# Altium project slave-12-ltc6811-1.PrjPcb (part 1 of 2)
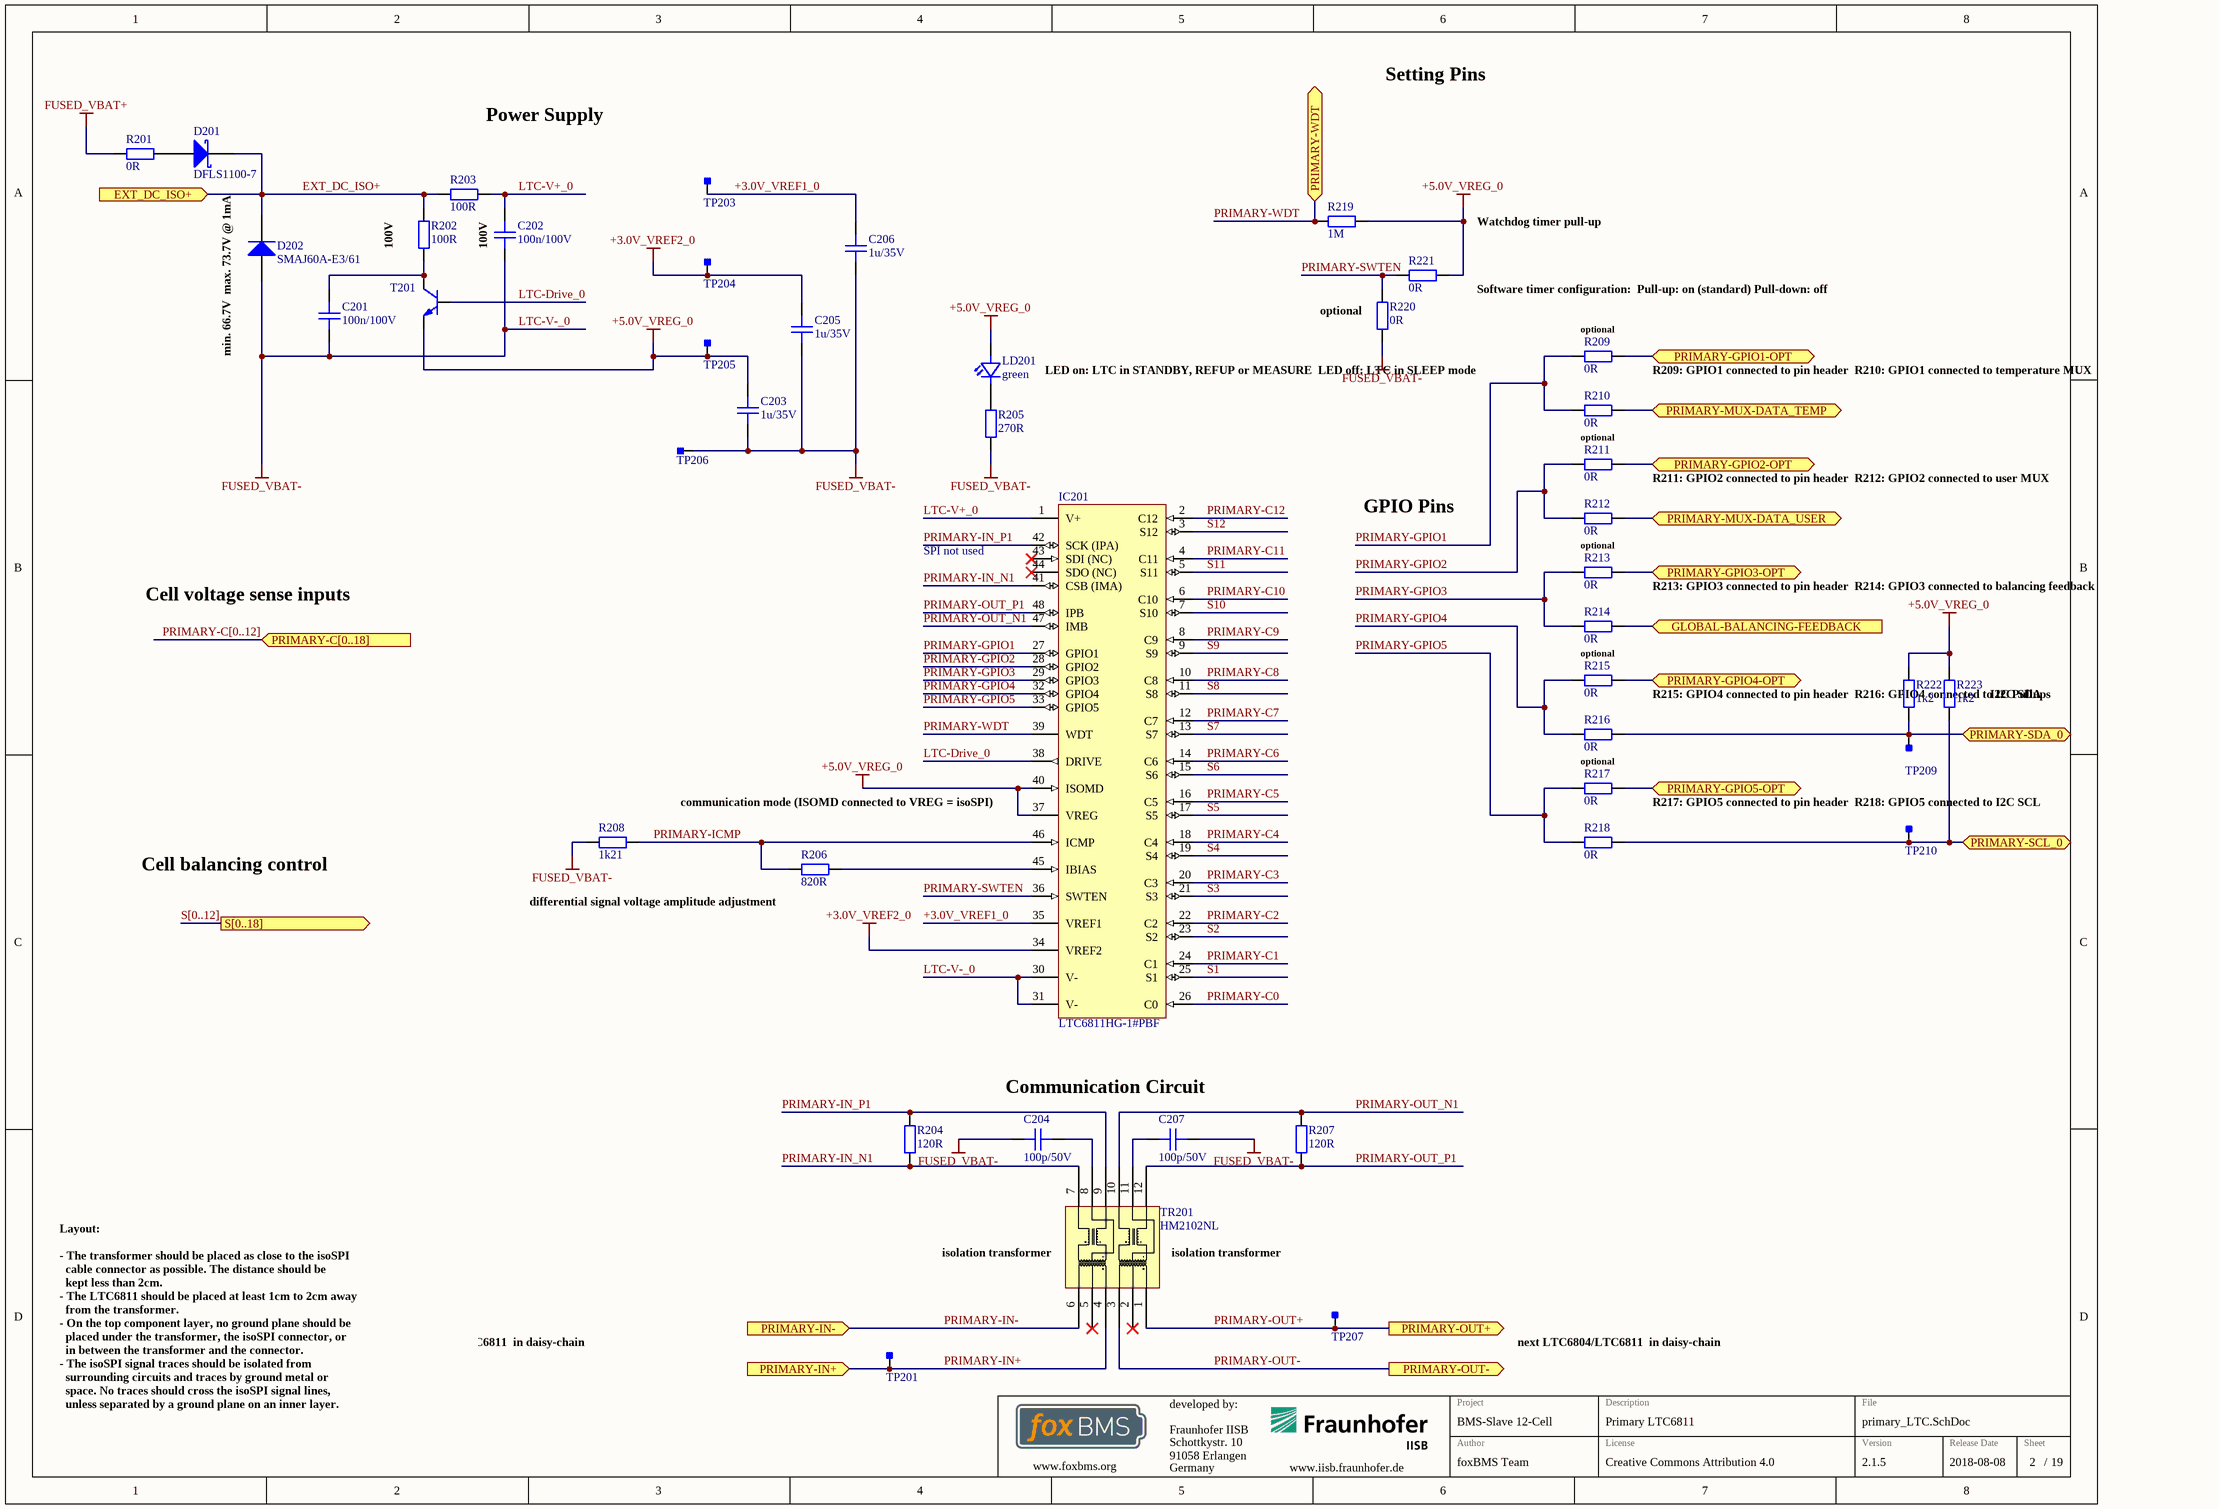
[diagram p0: primary_LTC.SchDoc]
GlobalDate: 2018-08-08; GlobalLicense: Creative Commons Attribution 4.0; GlobalProject: BMS-Slave 12-Cell; GlobalVersion: 2.1.5
13 sheets, 315 parts. Net scope: hierarchical (ports join the sheet entries above them; power ports are global).
Board file: slave.PcbDoc
Sheets:
  primary_LTC.SchDoc
  secondary_LTC.SchDoc
  cell_fuses.SchDoc
  primary_decoupling.SchDoc
  secondary_decoupling.SchDoc
  passive_balancing.SchDoc
  secon_analog_in.SchDoc
  secondary_DIO.SchDoc
  secondary_EEPROM_and_T.SchDoc
  connectors.SchDoc
  daisy_chain_connectors.SchDoc
  ext_supply_con.SchDoc
  bat_connectors.SchDoc

## Sheet primary_LTC.SchDoc: foxBMS BMS-Slave 12-Cell
size A3; DocumentNumber: 2; SheetNumber: 2; SheetTotal: 19; AUTHOR: Fraunhofer IISB foxBMS Team; SheetDescription: Primary LTC6811

### Parts
C201  100n/100V  [CAPC2012X14N]
C202  100n/100V  [CAPC2012X14N]
C203  1u/35V  [CAPC1608X08N]
C204  100p/50V  [CAPC1608X08N]
C205  1u/35V  [CAPC1608X08N]
C206  1u/35V  [CAPC1608X08N]
C207  100p/50V  [CAPC1608X08N]
D201  DFLS1100-7  [DIOD-POWERDI123-2_V]
D202  SMAJ60A-E3/61  [VISH-DO-214AC-2_N]
IC201  LTC6811HG-1#PBF  [LT-G-48_L]
LD201  green  [LEDC1608X07N]
R201  0R  [RESC2012X05N]
R202  100R  [RESC2012X05N]
R203  100R  [RESC2012X05N]
R204  120R  [RESC1608X05N]
R205  270R  [RESC1608X05N]
R206  820R  [RESC1608X05N]
R207  120R  [RESC1608X05N]
R208  1k21  [RESC1608X05N]
R209  0R  [RESC1608X05N]
R210  0R  [RESC1608X05N]
R211  0R  [RESC1608X05N]
R212  0R  [RESC1608X05N]
R213  0R  [RESC1608X05N]
R214  0R  [RESC1608X05N]
R215  0R  [RESC1608X05N]
R216  0R  [RESC1608X05N]
R217  0R  [RESC1608X05N]
R218  0R  [RESC1608X05N]
R219  1M  [RESC1608X05N]
R220  0R  [RESC1608X05N]
R221  0R  [RESC1608X05N]
R222  1k2  [RESC1608X05N]
R223  1k2  [RESC1608X05N]
T201  PBHV8115Z  [SOT230P700X180-4N]  (value not drawn)
TP201  Testpoint_Square  [Testpoint_S1]  (value not drawn)  (no BOM)
TP203  Testpoint_Square  [Testpoint_S1]  (value not drawn)  (no BOM)
TP204  Testpoint_Square  [Testpoint_S1]  (value not drawn)  (no BOM)
TP205  Testpoint_Square  [Testpoint_S1]  (value not drawn)  (no BOM)
TP206  Testpoint_Square  [Testpoint_S1]  (value not drawn)  (no BOM)
TP207  Testpoint_Square  [Testpoint_S1]  (value not drawn)  (no BOM)
TP209  Testpoint_Square  [Testpoint_S1]  (value not drawn)  (no BOM)
TP210  Testpoint_Square  [Testpoint_S1]  (value not drawn)  (no BOM)
TR201  HM2102NL  [HM2102NL]

### Ports
EXT_DC_ISO+ (in), GLOBAL-BALANCING-FEEDBACK (in), PRIMARY-C[0..18] (in), PRIMARY-GPIO1-OPT (bidir), PRIMARY-GPIO2-OPT (bidir), PRIMARY-GPIO3-OPT (bidir), PRIMARY-GPIO4-OPT (bidir), PRIMARY-GPIO5-OPT (bidir), PRIMARY-IN+ (in), PRIMARY-IN- (in), PRIMARY-MUX-DATA_TEMP (bidir), PRIMARY-MUX-DATA_USER (bidir), PRIMARY-OUT+ (out), PRIMARY-OUT- (out), PRIMARY-SCL_0 (bidir), PRIMARY-SDA_0 (bidir), PRIMARY-WDT (bidir), S[0..18] (out)

### Nets
+3.0V_VREF2_0: C205.2 IC201.34(VREF2) TP204.1
+5.0V_VREG_0: C203.2 IC201.37(VREG) IC201.40(ISOMD) LD201.2(A) R219.2 R221.2 R222.2 R223.2 T201.3(E) TP205.1
FUSED_VBAT+: R201.1
FUSED_VBAT-: C201.2 C202.2 C203.1 C204.1 C205.1 C206.1 C207.1 D202.2(A) IC201.30(V-) IC201.31(V-) R205.1 R208.1 R220.1 TP206.1  [also labelled LTC-V-_0]
+3.0V_VREF1_0: C206.2 IC201.35(VREF1) TP203.1
EXT_DC_ISO+: D201.2(K) D202.1(K) R202.2 R203.1 ; port EXT_DC_ISO+
LTC-Drive_0: IC201.38(DRIVE) T201.1(B)
LTC-V+_0: C202.1 IC201.1(V+) R203.2
PRIMARY-C0: IC201.26(C0)
PRIMARY-C1: IC201.24(C1)
PRIMARY-C2: IC201.22(C2)
PRIMARY-C3: IC201.20(C3)
PRIMARY-C4: IC201.18(C4)
PRIMARY-C5: IC201.16(C5)
PRIMARY-C6: IC201.14(C6)
PRIMARY-C7: IC201.12(C7)
PRIMARY-C8: IC201.10(C8)
PRIMARY-C9: IC201.8(C9)
PRIMARY-C10: IC201.6(C10)
PRIMARY-C11: IC201.4(C11)
PRIMARY-C12: IC201.2(C12)
PRIMARY-GPIO1: IC201.27(GPIO1) R209.2 R210.2
PRIMARY-GPIO2: IC201.28(GPIO2) R211.2 R212.2
PRIMARY-GPIO3: IC201.29(GPIO3) R213.2 R214.2
PRIMARY-GPIO4: IC201.32(GPIO4) R215.2 R216.2
PRIMARY-GPIO5: IC201.33(GPIO5) R217.2 R218.2
PRIMARY-ICMP: IC201.46(ICMP) R206.1 R208.2
PRIMARY-IN+: TP201.1 TR201.4 ; port PRIMARY-IN+
PRIMARY-IN-: TR201.6 ; port PRIMARY-IN-
PRIMARY-IN_N1: IC201.41(CSB_(IMA)) R204.2 TR201.7
PRIMARY-IN_P1: IC201.42(SCK_(IPA)) R204.1 TR201.9
PRIMARY-OUT+: TP207.1 TR201.1 ; port PRIMARY-OUT+
PRIMARY-OUT-: TR201.3 ; port PRIMARY-OUT-
PRIMARY-OUT_N1: IC201.47(IMB) R207.2 TR201.10
PRIMARY-OUT_P1: IC201.48(IPB) R207.1 TR201.12
PRIMARY-SWTEN: IC201.36(SWTEN) R220.2 R221.1
PRIMARY-WDT: IC201.39(WDT) R219.1 ; port PRIMARY-WDT
S1: IC201.25(S1)
S2: IC201.23(S2)
S3: IC201.21(S3)
S4: IC201.19(S4)
S5: IC201.17(S5)
S6: IC201.15(S6)
S7: IC201.13(S7)
S8: IC201.11(S8)
S9: IC201.9(S9)
S10: IC201.7(S10)
S11: IC201.5(S11)
S12: IC201.3(S12)
NetC201_1: C201.1 R202.1 T201.2(C) T201.4(C)
NetC204_2: C204.2 TR201.8
NetC207_2: C207.2 TR201.11
NetD201_1: D201.1(A) R201.2
NetIC201_45: IC201.45(IBIAS) R206.2
NetLD201_1: LD201.1(C) R205.2
NetR209_1: R209.1 ; port PRIMARY-GPIO1-OPT
NetR210_1: R210.1 ; port PRIMARY-MUX-DATA_TEMP
NetR211_1: R211.1 ; port PRIMARY-GPIO2-OPT
NetR212_1: R212.1 ; port PRIMARY-MUX-DATA_USER
NetR213_1: R213.1 ; port PRIMARY-GPIO3-OPT
NetR214_1: R214.1 ; port GLOBAL-BALANCING-FEEDBACK
NetR215_1: R215.1 ; port PRIMARY-GPIO4-OPT
NetR216_1: R216.1 R222.1 TP209.1 ; port PRIMARY-SDA_0
NetR217_1: R217.1 ; port PRIMARY-GPIO5-OPT
NetR218_1: R218.1 R223.1 TP210.1 ; port PRIMARY-SCL_0

Not connected (* = marked no-connect by the designer): IC201 43(SDI_(NC))* 44(SDO_(NC))*; TR201 2* 5*

### Buses and harness runs
bus PRIMARY-C[0..12] = port PRIMARY-C[0..18]
bus S[0..12] = port S[0..18]

### Notes on the sheet
- Setting Pins
- Power Supply
- (near R202) 100V
- (near C202) 100V
- Watchdog timer pull-up
- min. 66.7V
  max. 73.7V @ 1mA
- (near R220) optional
- Software timer configuration:
  Pull-up: on (standard)
  Pull-down: off
- LED on: LTC in STANDBY, REFUP or MEASURE
  LED off: LTC in SLEEP mode
- (near R209) optional
- R209: GPIO1 connected to pin header
  R210: GPIO1 connected to temperature MUX
- optional
- GPIO Pins
- R211: GPIO2 connected to pin header
  R212: GPIO2 connected to user MUX
- SPI not used
- R213: GPIO3 connected to pin header
  R214: GPIO3 connected to balancing feedback
- Cell voltage sense inputs
- R215: GPIO4 connected to pin header
  R216: GPIO4 connected to I2C SDA
- (near R223) I2C Pullups
- communication mode (ISOMD connected to VREG = isoSPI)
- (near TP210) R217: GPIO5 connected to pin header
  R218: GPIO5 connected to I2C SCL
- Cell balancing control
- (near R206) differential signal voltage amplitude adjustment
- Communication Circuit
- (near TR201) isolation transformer
- previous LTC6804/LTC6811
  in daisy-chain
- next LTC6804/LTC6811
  in daisy-chain
- Layout:
  - The transformer should be placed as close to the isoSPI
  cable connector as possible. The distance should be
  kept less than 2cm.
  - The LTC6811 should be placed at least 1cm to 2cm away
  from the transformer.
  - On the top component layer, no ground plane should be
  placed under the transformer, the isoSPI connector, or
  in between the transformer and the connector.
  - The isoSPI signal traces should be isolated from
  surrounding circuits and traces by ground metal or
  space. No traces should cross the isoSPI signal lines,
  unless separated by a ground plane on an inner layer.
- Fraunhofer IISB
- Schottkystr. 10
- developed by:
- 91058 Erlangen
- Germany
- Author
- Project
- License
- Description
- File
- Version
- Release Date
- Sheet
- www.foxbms.org
- www.iisb.fraunhofer.de
- foxBMS Team
- /

### Library data of the parts
C201 C202 = gen_C_ceramic_100n_100V_X7R_0805: MLCC; Capacitance: 100n; Rated Voltage: 100V; Dielectric: X7R; Case EIA: 0805; Case Metric: 2012; Automotive Qualified: False; Part Number: gen_C_ceramic_100n_100V_X7R_0805; Supplier 1: Farnell; Supplier Part Number 1: 2320821
C203 C205 C206 = gen_C_ceramic_1u_35V_X7R_0603: MLCC; Capacitance: 1u; Rated Voltage: 35V; Dielectric: X7R; Case EIA: 0603; Case Metric: 1608; PnP Package: C_0603_10; PnP Value: 1uF/35V/X7R; PnP equipped: x; Automotive Qualified: False; Part Number: gen_C_ceramic_1u_35V_X7R_0603; Supplier 1: Farnell; Supplier Part Number 1: 1907508
C204 C207 = gen_C_ceramic_100p_50V_C0G_0603: MLCC; Capacitance: 100p; Rated Voltage: 50V; Dielectric: C0G; Case EIA: 0603; Case Metric: 1608; Automotive Qualified: False; Part Number: gen_C_ceramic_100p_50V_C0G_0603; Supplier 1: Farnell; Supplier Part Number 1: 1414603
D201 = CMP-2000-05099-1: 1 A High Voltage Schottky Barrier Rectifier, 0.62 V, -55 to 175 degC, 2- Pin POWERDI123, Pb-Free, Tape and Reel; Manufacturer: Diodes Inc; Average Rectified Current-Max: 1A; Peak Current-Max: 40A; Forward Voltage: 0.77V; Reverse Current-Max: 1µA; Reverse Voltage-Max [Vrrm]: 100V; Datasheet Version: Sep-14; Datasheet URL: https://datasheet.ciiva.com/15144/getdatasheetpartid-44146-15144126.pdf; Manufacturer URL: http://www.diodes.com/
D202 = CMP-0548-00258-2: Transient Voltage Suppressor, 6.40 to 231 V, 60 V Stand-off Voltage, Uni-Directional, -55 to 155 degC, 2-pin DO-214AC, Pb-Free, Tape and Reel; Manufacturer: Vishay Semiconductor; VWM (V): 60; PPPM (W): 400, 300; VBR Uni-Directional (V): 6.4 to 231; IFSM: 40 A; ID (uA): 1; RoHS: TRUE; ComponentLink3Description: Package Specification; PackageReference: DO-214AC-2; PartNumber: SMAJ60A-E3/61; ComponentLink2Description: Datasheet; ComponentLink2URL: http://www.vishay.com/docs/88390/smaj50a.pdf; ComponentLink3URL: http://www.vishay.com/docs/88390/smaj50a.pdf; Packing: Tape and Reel; ComponentLink1Description: Manufacturer URL; PackageDescription: 2-Pin DO-214AC (SMA), Body 4.245 x 2.665 mm; DatasheetVersion: 12/8/2013; ComponentLink1URL: http://www.vishay.com/; Operating Junction and Storage Temperature Range: -55 to 150 degC; Mounting Technology: Surface Mount
IC201 = LTC6811HG-1#PBF: Multicell Battery Monitor, 60 V Vin MAX, 48-pin SOP (G-48), -40 to 125 degC, Pb-Free; Manufacturer: Linear Technology; Type of Charger: Battery Stack Monitor; Vin Max(V): 60; Battery Chemistry: Li-Ion, Li-Polymer, NiMH; Number of Cells: > 1000 V of stacked Li-Ion cells; Automotive Qualified: False; RoHS: TRUE; ComponentLink1Description: Datasheet; ComponentLink1URL: https://cds.linear.com/docs/en/datasheet/68111fb.pdf; PartNumber: LTC6811HG-1#PBF; PackageReference: G-48; PackageVersion: Rev. Ã˜, 01/2011; ComponentLink2Description: Datasheet; Mounting Technology: Surface Mount; ComponentLink3Description: Package Specification; PackageDescription: 48-Pin Plastic SSOP, Body 12.8 x 5.3 mm, Pitch 0.5 mm; ComponentLink3URL: http://cds.linear.com/docs/en/packaging/05081887_0_G48.pdf; ComponentLink2URL: http://cds.linear.com/docs/en/datasheet/680412f.pdf; Part Number: LTC6811HG-1#PBF; Part Name: LTC6811HG-1#PBF; Operating Temperature: -40°C - +125°C; Supplier 1: Digikey; Supplier Part Number 1: LTC6811HG-1#PBF-ND
LD201 = gen_LED_0603_green: LED; Breakdown Voltage: 5V; Continuous Forward Current: 20mA; Forward Voltage @ 20mA: 2.2V; Automotive Qualified: False; Part Number: gen_LED_0603_green; Color: green; Supplier 1: Farnell; Supplier Part Number 1: 2099223; PnP Package: LED_0603
R201 = gen_R_0R_0805: SMD Resistor 0R 0805; Power: 0.125W; Case EIA: 0805; Case Metric: 2012; Maximum Working Voltage: 150V; PnP Package: R_0805; Automotive Qualified: False; Part Number: gen_R_0R_0805; Operating Temperature: -55°C - +155°C; Resistance: 0R; Series: Jumper; PnP Value: 0R; Supplier 1: Farnell; Supplier Part Number 1: 2057661
R202 R203 = gen_R_100R_0805: SMD Resistor 100R 0805; Tolerance: 1%; Power: 0.125W; Case EIA: 0805; Case Metric: 2012; Maximum Working Voltage: 150V; PnP Package: R_0805; Automotive Qualified: False; Part Number: gen_R_100R_0805; Operating Temperature: -55°C - +155°C; Resistance: 100R; Series: E24, E96; PnP Value: 100R; Supplier 1: Farnell; Supplier Part Number 1: 1469862
R204 R207 = gen_R_120R_0603: SMD Resistor 120R 0603; Tolerance: 1%; Power: 0.1W; Case EIA: 0603; Case Metric: 1608; Maximum Working Voltage: 75V; PnP Package: R_0603; Automotive Qualified: False; Part Number: gen_R_120R_0603; Operating Temperature: -55°C - +155°C; Resistance: 120R; Series: E24; PnP Value: 120R; Supplier 1: Farnell; Supplier Part Number 1: 2073369
R205 = gen_R_270R_0603: SMD Resistor 270R 0603; Tolerance: 1%; Power: 0.1W; Case EIA: 0603; Case Metric: 1608; Maximum Working Voltage: 75V; PnP Package: R_0603; Automotive Qualified: False; Part Number: gen_R_270R_0603; Operating Temperature: -55°C - +155°C; Resistance: 270R; Series: E24; PnP Value: 270R; Supplier 1: Farnell; Supplier Part Number 1: 2141320
R206 = gen_R_820R_0603: SMD Resistor 820R 0603; Tolerance: 1%; Power: 0.1W; Case EIA: 0603; Case Metric: 1608; Maximum Working Voltage: 75V; PnP Package: R_0603; Automotive Qualified: False; Part Number: gen_R_820R_0603; Operating Temperature: -55°C - +155°C; Resistance: 820R; Series: E24; PnP Value: 820R; Supplier 1: Farnell; Supplier Part Number 1: 1469841
R208 = gen_R_1k21_0603: SMD Resistor 1k21 0603; Tolerance: 1%; Power: 0.1W; Case EIA: 0603; Case Metric: 1608; Maximum Working Voltage: 75V; PnP Package: R_0603; Automotive Qualified: False; Part Number: gen_R_1k21_0603; Operating Temperature: -55°C - +155°C; Resistance: 1k21; Series: E96; PnP Value: 1k21; Supplier 1: Farnell; Supplier Part Number 1: 1652852
R209-R218 R220 R221 = gen_R_0R_0603: SMD Resistor 0R 0603; Power: 0.1W; Case EIA: 0603; Case Metric: 1608; Maximum Working Voltage: 75V; PnP Package: R_0603; Automotive Qualified: False; Part Number: gen_R_0R_0603; Operating Temperature: -55°C - +155°C; Resistance: 0R; Series: Jumper; PnP Value: 0R; Supplier 1: Farnell; Supplier Part Number 1: 2073345
R219 = gen_R_1M_0603: SMD Resistor 1M 0603; Tolerance: 1%; Power: 0.1W; Case EIA: 0603; Case Metric: 1608; Maximum Working Voltage: 75V; PnP Package: R_0603; Automotive Qualified: False; Part Number: gen_R_1M_0603; Operating Temperature: -55°C - +155°C; Resistance: 1M; Series: E24, E96; PnP Value: 1M; Supplier 1: Farnell; Supplier Part Number 1: 1469746
R222 R223 = gen_R_1k2_0603: SMD Resistor 1k2 0603; Tolerance: 1%; Power: 0.1W; Case EIA: 0603; Case Metric: 1608; Maximum Working Voltage: 75V; PnP Package: R_0603; Automotive Qualified: False; Part Number: gen_R_1k2_0603; Operating Temperature: -55°C - +155°C; Resistance: 1k2; Series: E24; PnP Value: 1k2; Supplier 1: Farnell; Supplier Part Number 1: 2073370
T201 = PBHV8115Z: 150 V, 1 A NPN high-voltage low V / CEsat / (BISS) transistor; Manufacturer: Nexperia; Maximum Drain-Source Voltage: 150V; Maximum Continous Drain Current (25°C): 1A; Automotive Qualified: True; Part Number: PBHV8115Z; Part Name: NPN; Operating Temperature: -55°C - +150°C; ComponentLink1Description: Datasheet; ComponentLink1URL: http://www.farnell.com/datasheets/609423.pdf; Supplier 1: Farnell; Supplier Part Number 1: 1829309
TP201 TP203-TP207 TP209 TP210 = Testpoint_Square: Testpoint, square; Part Number: Testpoint_Square
TR201 = HM2102NL: Pulse HM2102NL BMS Transformer; Automotive Qualified: True; Part Number: HM2102NL; Manufacturer: Pulse; Operating Temperature: -40°C - +125°C; ComponentLink1Description: Datasheet; ComponentLink1URL: https://www.mouser.com/ds/2/336/HM2102NL-1218600.pdf; Supplier 1: Mouser; Supplier Part Number 1: 673-HM2102NL; Supplier 2: Digikey; Supplier Part Number 2: 1840-1034-1-ND

## Sheet secondary_LTC.SchDoc: foxBMS BMS-Slave 12-Cell
size A3; DocumentNumber: 3; SheetNumber: 3; SheetTotal: 19; AUTHOR: Fraunhofer IISB foxBMS Team; SheetDescription: Secondary LTC6811
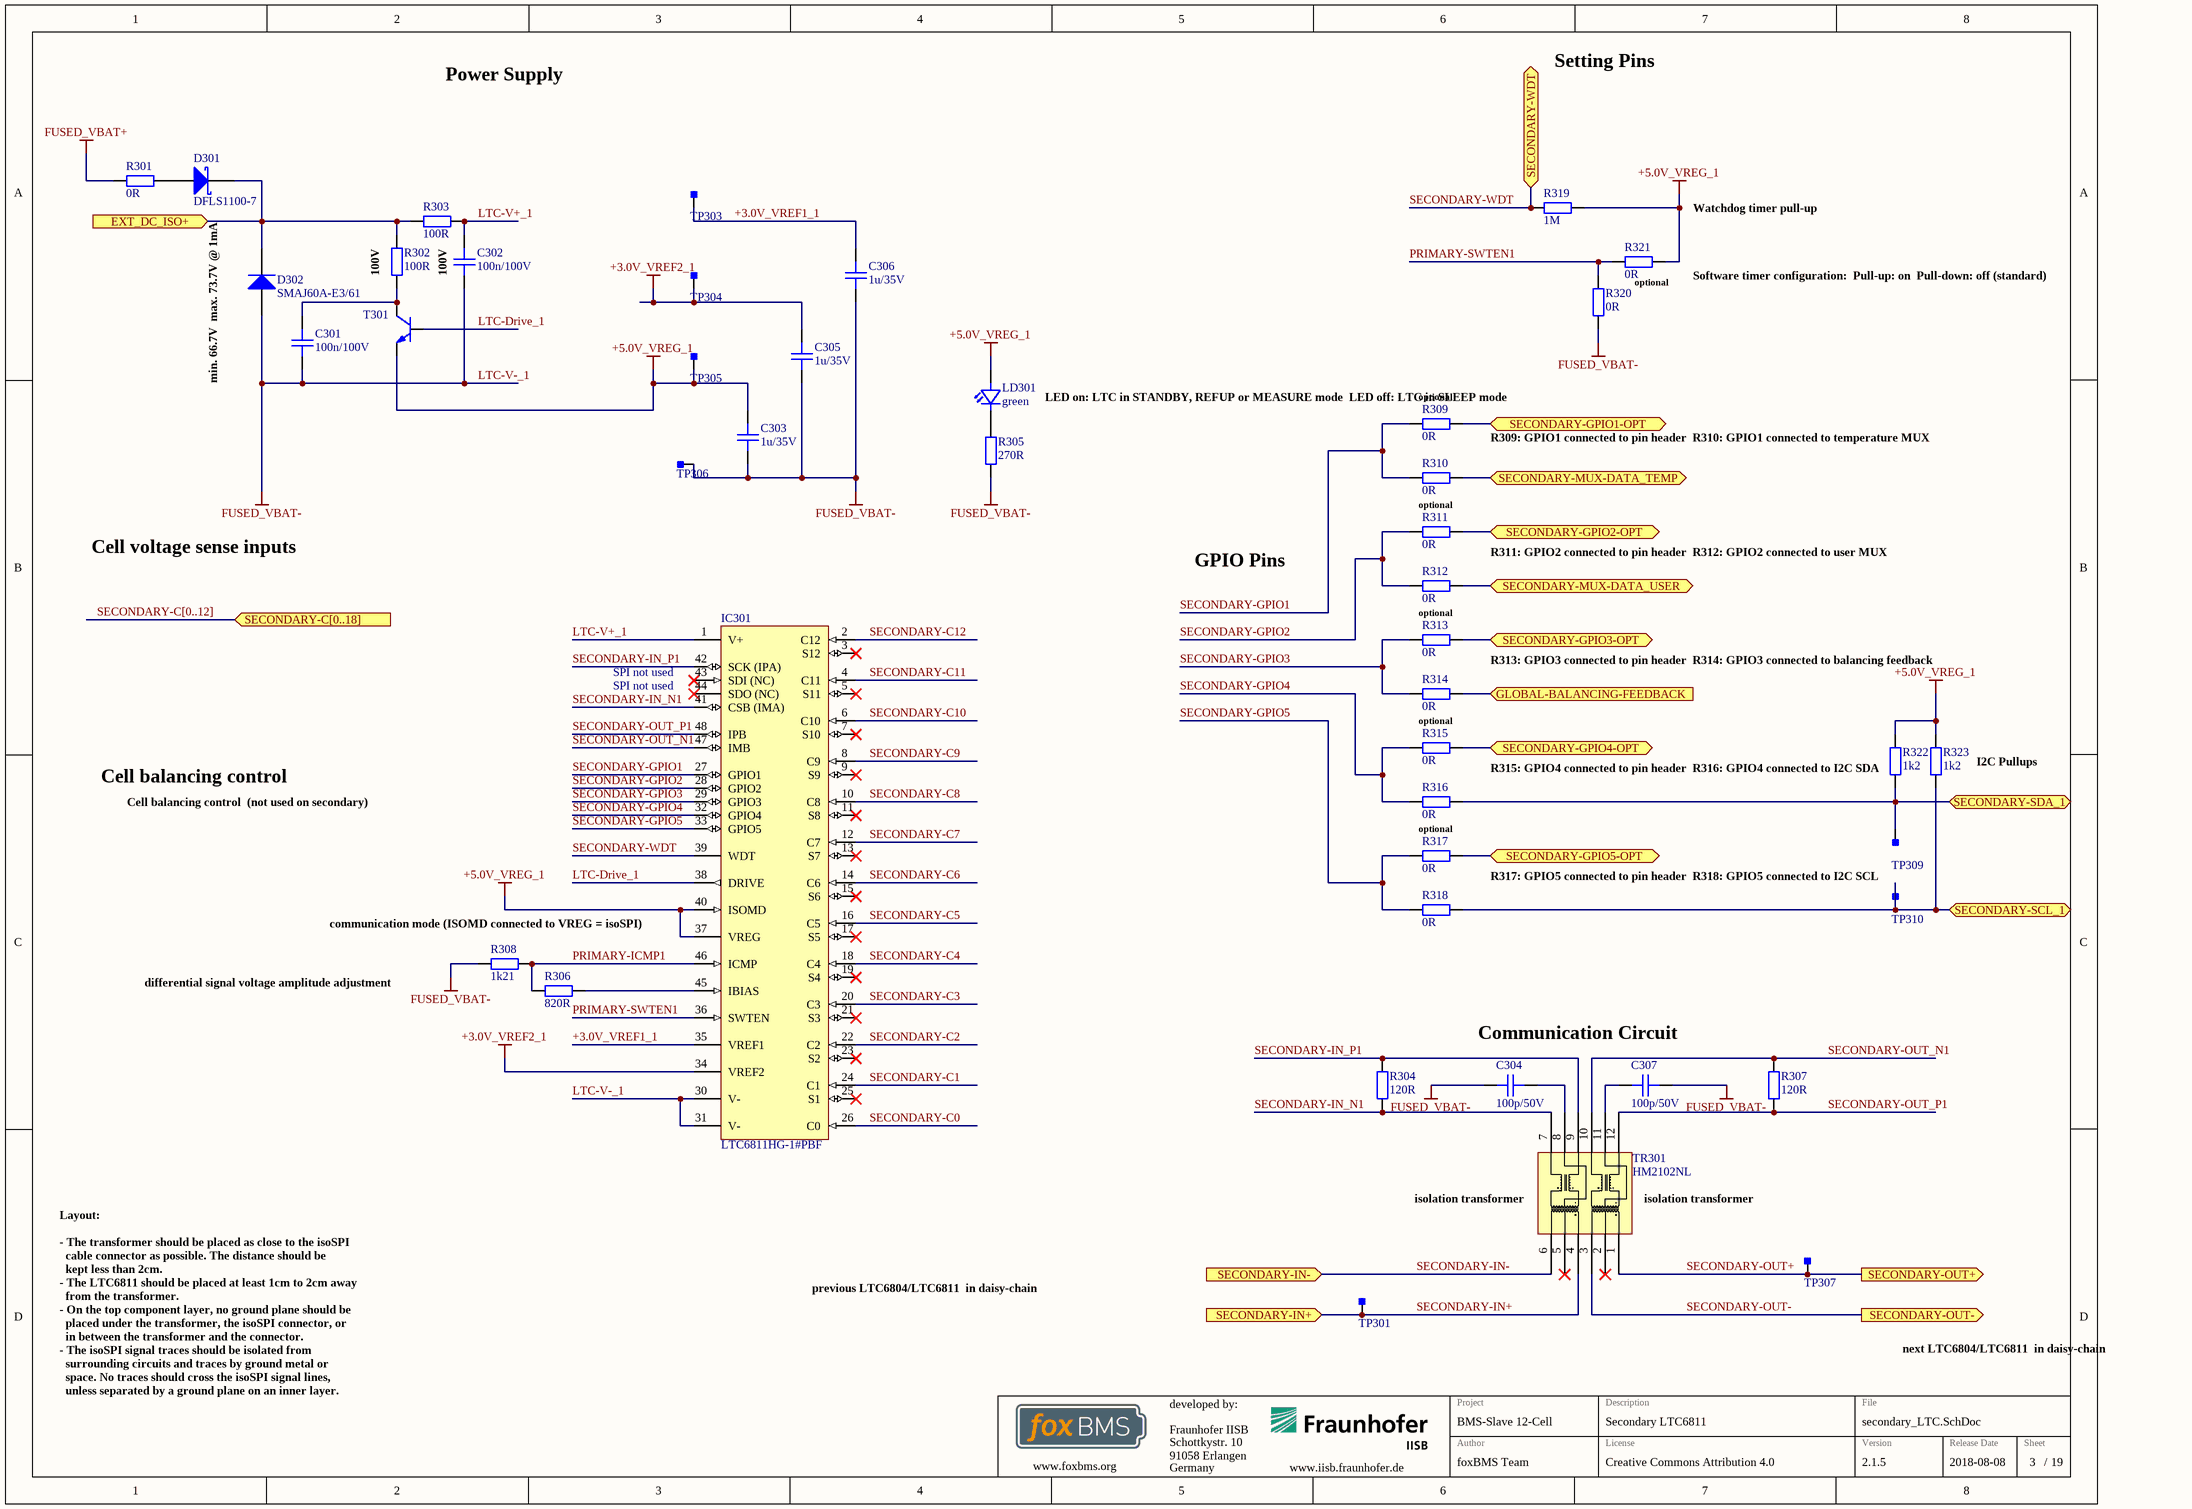
[diagram p1: secondary_LTC.SchDoc]

### Parts
C301  100n/100V  [CAPC2012X14N]
C302  100n/100V  [CAPC2012X14N]
C303  1u/35V  [CAPC1608X08N]
C304  100p/50V  [CAPC1608X08N]
C305  1u/35V  [CAPC1608X08N]
C306  1u/35V  [CAPC1608X08N]
C307  100p/50V  [CAPC1608X08N]
D301  DFLS1100-7  [DIOD-POWERDI123-2_V]
D302  SMAJ60A-E3/61  [VISH-DO-214AC-2_N]
IC301  LTC6811HG-1#PBF  [LT-G-48_L]
LD301  green  [LEDC1608X07N]
R301  0R  [RESC2012X05N]
R302  100R  [RESC2012X05N]
R303  100R  [RESC2012X05N]
R304  120R  [RESC1608X05N]
R305  270R  [RESC1608X05N]
R306  820R  [RESC1608X05N]
R307  120R  [RESC1608X05N]
R308  1k21  [RESC1608X05N]
R309  0R  [RESC1608X05N]
R310  0R  [RESC1608X05N]
R311  0R  [RESC1608X05N]
R312  0R  [RESC1608X05N]
R313  0R  [RESC1608X05N]
R314  0R  [RESC1608X05N]
R315  0R  [RESC1608X05N]
R316  0R  [RESC1608X05N]
R317  0R  [RESC1608X05N]
R318  0R  [RESC1608X05N]
R319  1M  [RESC1608X05N]
R320  0R  [RESC1608X05N]
R321  0R  [RESC1608X05N]
R322  1k2  [RESC1608X05N]
R323  1k2  [RESC1608X05N]
T301  PBHV8115Z  [SOT230P700X180-4N]  (value not drawn)
TP301  Testpoint_Square  [Testpoint_S1]  (value not drawn)  (no BOM)
TP303  Testpoint_Square  [Testpoint_S1]  (value not drawn)  (no BOM)
TP304  Testpoint_Square  [Testpoint_S1]  (value not drawn)  (no BOM)
TP305  Testpoint_Square  [Testpoint_S1]  (value not drawn)  (no BOM)
TP306  Testpoint_Square  [Testpoint_S1]  (value not drawn)  (no BOM)
TP307  Testpoint_Square  [Testpoint_S1]  (value not drawn)  (no BOM)
TP309  Testpoint_Square  [Testpoint_S1]  (value not drawn)  (no BOM)
TP310  Testpoint_Square  [Testpoint_S1]  (value not drawn)  (no BOM)
TR301  HM2102NL  [HM2102NL]

### Ports
EXT_DC_ISO+ (in), GLOBAL-BALANCING-FEEDBACK (in), SECONDARY-C[0..18] (in), SECONDARY-GPIO1-OPT (bidir), SECONDARY-GPIO2-OPT (bidir), SECONDARY-GPIO3-OPT (bidir), SECONDARY-GPIO4-OPT (bidir), SECONDARY-GPIO5-OPT (bidir), SECONDARY-IN+ (in), SECONDARY-IN- (in), SECONDARY-MUX-DATA_TEMP (bidir), SECONDARY-MUX-DATA_USER (bidir), SECONDARY-OUT+ (out), SECONDARY-OUT- (out), SECONDARY-SCL_1 (bidir), SECONDARY-SDA_1 (bidir), SECONDARY-WDT (bidir)

### Nets
+3.0V_VREF2_1: C305.2 IC301.34(VREF2) TP304.1
+5.0V_VREG_1: C303.2 IC301.37(VREG) IC301.40(ISOMD) LD301.2(A) R319.2 R321.2 R322.2 R323.2 T301.3(E) TP305.1
FUSED_VBAT+: R301.1
FUSED_VBAT-: C301.2 C302.2 C303.1 C304.1 C305.1 C306.1 C307.1 D302.2(A) IC301.30(V-) IC301.31(V-) R305.1 R308.1 R320.1 TP306.1  [also labelled LTC-V-_1]
+3.0V_VREF1_1: C306.2 IC301.35(VREF1) TP303.1
LTC-Drive_1: IC301.38(DRIVE) T301.1(B)
LTC-V+_1: C302.1 IC301.1(V+) R303.2
PRIMARY-ICMP1: IC301.46(ICMP) R306.1 R308.2
PRIMARY-SWTEN1: IC301.36(SWTEN) R320.2 R321.1
SECONDARY-C0: IC301.26(C0)
SECONDARY-C1: IC301.24(C1)
SECONDARY-C2: IC301.22(C2)
SECONDARY-C3: IC301.20(C3)
SECONDARY-C4: IC301.18(C4)
SECONDARY-C5: IC301.16(C5)
SECONDARY-C6: IC301.14(C6)
SECONDARY-C7: IC301.12(C7)
SECONDARY-C8: IC301.10(C8)
SECONDARY-C9: IC301.8(C9)
SECONDARY-C10: IC301.6(C10)
SECONDARY-C11: IC301.4(C11)
SECONDARY-C12: IC301.2(C12)
SECONDARY-GPIO1: IC301.27(GPIO1) R309.2 R310.2
SECONDARY-GPIO2: IC301.28(GPIO2) R311.2 R312.2
SECONDARY-GPIO3: IC301.29(GPIO3) R313.2 R314.2
SECONDARY-GPIO4: IC301.32(GPIO4) R315.2 R316.2
SECONDARY-GPIO5: IC301.33(GPIO5) R317.2 R318.2
SECONDARY-IN+: TP301.1 TR301.4 ; port SECONDARY-IN+
SECONDARY-IN-: TR301.6 ; port SECONDARY-IN-
SECONDARY-IN_N1: IC301.41(CSB_(IMA)) R304.2 TR301.7
SECONDARY-IN_P1: IC301.42(SCK_(IPA)) R304.1 TR301.9
SECONDARY-OUT+: TP307.1 TR301.1 ; port SECONDARY-OUT+
SECONDARY-OUT-: TR301.3 ; port SECONDARY-OUT-
SECONDARY-OUT_N1: IC301.47(IMB) R307.2 TR301.10
SECONDARY-OUT_P1: IC301.48(IPB) R307.1 TR301.12
SECONDARY-WDT: IC301.39(WDT) R319.1 ; port SECONDARY-WDT
NetC301_1: C301.1 R302.1 T301.2(C) T301.4(C)
NetC304_2: C304.2 TR301.8
NetC307_2: C307.2 TR301.11
NetD301_1: D301.1(A) R301.2
NetD301_2: D301.2(K) D302.1(K) R302.2 R303.1 ; port EXT_DC_ISO+
NetIC301_45: IC301.45(IBIAS) R306.2
NetLD301_1: LD301.1(C) R305.2
NetR309_1: R309.1 ; port SECONDARY-GPIO1-OPT
NetR310_1: R310.1 ; port SECONDARY-MUX-DATA_TEMP
NetR311_1: R311.1 ; port SECONDARY-GPIO2-OPT
NetR312_1: R312.1 ; port SECONDARY-MUX-DATA_USER
NetR313_1: R313.1 ; port SECONDARY-GPIO3-OPT
NetR314_1: R314.1 ; port GLOBAL-BALANCING-FEEDBACK
NetR315_1: R315.1 ; port SECONDARY-GPIO4-OPT
NetR316_1: R316.1 R322.1 TP309.1 ; port SECONDARY-SDA_1
NetR317_1: R317.1 ; port SECONDARY-GPIO5-OPT
NetR318_1: R318.1 R323.1 TP310.1 ; port SECONDARY-SCL_1

Not connected (* = marked no-connect by the designer): IC301 3(S12)* 5(S11)* 7(S10)* 9(S9)* 11(S8)* 13(S7)* 15(S6)* 17(S5)* 19(S4)* 21(S3)* 23(S2)* 25(S1)* 43(SDI_(NC))* 44(SDO_(NC))*; TR301 2* 5*

### Buses and harness runs
bus SECONDARY-C[0..12] = port SECONDARY-C[0..18]

### Notes on the sheet
- Power Supply
- Setting Pins
- Watchdog timer pull-up
- min. 66.7V
  max. 73.7V @ 1mA
- (near R302) 100V
- (near C302) 100V
- (near R321) optional
- (near R321) Software timer configuration:
  Pull-up: on
  Pull-down: off (standard)
- (near R309) LED on: LTC in STANDBY, REFUP or MEASURE mode
  LED off: LTC in SLEEP mode
- (near R309) optional
- R309: GPIO1 connected to pin header
  R310: GPIO1 connected to temperature MUX
- optional
- Cell voltage sense inputs
- GPIO Pins
- R311: GPIO2 connected to pin header
  R312: GPIO2 connected to user MUX
- (near IC301) SPI not used
- R313: GPIO3 connected to pin header
  R314: GPIO3 connected to balancing feedback
- Cell balancing control
- (near R322) R315: GPIO4 connected to pin header
  R316: GPIO4 connected to I2C SDA
- (near R323) I2C Pullups
- Cell balancing control
  (not used on secondary)
- (near R308) communication mode (ISOMD connected to VREG = isoSPI)
- (near TP310) R317: GPIO5 connected to pin header
  R318: GPIO5 connected to I2C SCL
- differential signal voltage amplitude adjustment
- Communication Circuit
- (near TR301) isolation transformer
- previous LTC6804/LTC6811
  in daisy-chain
- next LTC6804/LTC6811
  in daisy-chain
- Layout:
  - The transformer should be placed as close to the isoSPI
  cable connector as possible. The distance should be
  kept less than 2cm.
  - The LTC6811 should be placed at least 1cm to 2cm away
  from the transformer.
  - On the top component layer, no ground plane should be
  placed under the transformer, the isoSPI connector, or
  in between the transformer and the connector.
  - The isoSPI signal traces should be isolated from
  surrounding circuits and traces by ground metal or
  space. No traces should cross the isoSPI signal lines,
  unless separated by a ground plane on an inner layer.
- Fraunhofer IISB
- Schottkystr. 10
- developed by:
- 91058 Erlangen
- Germany
- Author
- Project
- License
- Description
- File
- Version
- Release Date
- Sheet
- www.foxbms.org
- www.iisb.fraunhofer.de
- foxBMS Team
- /

### Library data of the parts
C301 C302 = gen_C_ceramic_100n_100V_X7R_0805: as C201 on sheet primary_LTC; Part Number: gen_C_ceramic_100n_100V_X7R_0805; Supplier 1: Farnell; Supplier Part Number 1: 2320821
C303 C305 C306 = gen_C_ceramic_1u_35V_X7R_0603: as C203 on sheet primary_LTC; Part Number: gen_C_ceramic_1u_35V_X7R_0603; Supplier 1: Farnell; Supplier Part Number 1: 1907508
C304 C307 = gen_C_ceramic_100p_50V_C0G_0603: as C204 on sheet primary_LTC; Part Number: gen_C_ceramic_100p_50V_C0G_0603; Supplier 1: Farnell; Supplier Part Number 1: 1414603
D301 = CMP-2000-05099-1: as D201 on sheet primary_LTC; Datasheet Version: Sep-14; Datasheet URL: https://datasheet.ciiva.com/15144/getdatasheetpartid-44146-15144126.pdf; Manufacturer URL: http://www.diodes.com/
D302 = CMP-0548-00258-2: as D202 on sheet primary_LTC; RoHS: TRUE; ComponentLink3Description: Package Specification; PackageReference: DO-214AC-2; PartNumber: SMAJ60A-E3/61; ComponentLink2Description: Datasheet; ComponentLink2URL: http://www.vishay.com/docs/88390/smaj50a.pdf; ComponentLink3URL: http://www.vishay.com/docs/88390/smaj50a.pdf; Packing: Tape and Reel; ComponentLink1Description: Manufacturer URL; PackageDescription: 2-Pin DO-214AC (SMA), Body 4.245 x 2.665 mm; DatasheetVersion: 12/8/2013; ComponentLink1URL: http://www.vishay.com/; Operating Junction and Storage Temperature Range: -55 to 150 degC; Mounting Technology: Surface Mount
IC301 = LTC6811HG-1#PBF: as IC201 on sheet primary_LTC; RoHS: TRUE; ComponentLink1Description: Datasheet; ComponentLink1URL: https://cds.linear.com/docs/en/datasheet/68111fb.pdf; PartNumber: LTC6811HG-1#PBF; PackageReference: G-48; PackageVersion: Rev. Ã˜, 01/2011; ComponentLink2Description: Datasheet; Mounting Technology: Surface Mount; ComponentLink3Description: Package Specification; PackageDescription: 48-Pin Plastic SSOP, Body 12.8 x 5.3 mm, Pitch 0.5 mm; ComponentLink3URL: http://cds.linear.com/docs/en/packaging/05081887_0_G48.pdf; ComponentLink2URL: http://cds.linear.com/docs/en/datasheet/680412f.pdf; Part Number: LTC6811HG-1#PBF; Part Name: LTC6811HG-1#PBF; Operating Temperature: -40°C - +125°C; Supplier 1: Digikey; Supplier Part Number 1: LTC6811HG-1#PBF-ND
LD301 = gen_LED_0603_green: as LD201 on sheet primary_LTC; Part Number: gen_LED_0603_green; Color: green; Supplier 1: Farnell; Supplier Part Number 1: 2099223; PnP Package: LED_0603
R301 = gen_R_0R_0805: as R201 on sheet primary_LTC; Part Number: gen_R_0R_0805; Operating Temperature: -55°C - +155°C; Resistance: 0R; Series: Jumper; PnP Value: 0R; Supplier 1: Farnell; Supplier Part Number 1: 2057661
R302 R303 = gen_R_100R_0805: as R202 on sheet primary_LTC; Part Number: gen_R_100R_0805; Operating Temperature: -55°C - +155°C; Resistance: 100R; Series: E24, E96; PnP Value: 100R; Supplier 1: Farnell; Supplier Part Number 1: 1469862
R304 R307 = gen_R_120R_0603: as R204 on sheet primary_LTC; Part Number: gen_R_120R_0603; Operating Temperature: -55°C - +155°C; Resistance: 120R; Series: E24; PnP Value: 120R; Supplier 1: Farnell; Supplier Part Number 1: 2073369
R305 = gen_R_270R_0603: as R205 on sheet primary_LTC; Part Number: gen_R_270R_0603; Operating Temperature: -55°C - +155°C; Resistance: 270R; Series: E24; PnP Value: 270R; Supplier 1: Farnell; Supplier Part Number 1: 2141320
R306 = gen_R_820R_0603: as R206 on sheet primary_LTC; Part Number: gen_R_820R_0603; Operating Temperature: -55°C - +155°C; Resistance: 820R; Series: E24; PnP Value: 820R; Supplier 1: Farnell; Supplier Part Number 1: 1469841
R308 = gen_R_1k21_0603: as R208 on sheet primary_LTC; Part Number: gen_R_1k21_0603; Operating Temperature: -55°C - +155°C; Resistance: 1k21; Series: E96; PnP Value: 1k21; Supplier 1: Farnell; Supplier Part Number 1: 1652852
R309-R318 R320 R321 = gen_R_0R_0603: as R209 on sheet primary_LTC; Part Number: gen_R_0R_0603; Operating Temperature: -55°C - +155°C; Resistance: 0R; Series: Jumper; PnP Value: 0R; Supplier 1: Farnell; Supplier Part Number 1: 2073345
R319 = gen_R_1M_0603: as R219 on sheet primary_LTC; Part Number: gen_R_1M_0603; Operating Temperature: -55°C - +155°C; Resistance: 1M; Series: E24, E96; PnP Value: 1M; Supplier 1: Farnell; Supplier Part Number 1: 1469746
R322 R323 = gen_R_1k2_0603: as R222 on sheet primary_LTC; Part Number: gen_R_1k2_0603; Operating Temperature: -55°C - +155°C; Resistance: 1k2; Series: E24; PnP Value: 1k2; Supplier 1: Farnell; Supplier Part Number 1: 2073370
T301 = PBHV8115Z: as T201 on sheet primary_LTC; Part Number: PBHV8115Z; Part Name: NPN; Operating Temperature: -55°C - +150°C; ComponentLink1Description: Datasheet; ComponentLink1URL: http://www.farnell.com/datasheets/609423.pdf; Supplier 1: Farnell; Supplier Part Number 1: 1829309
TP301 TP303-TP307 TP309 TP310 = Testpoint_Square: Testpoint, square; Part Number: Testpoint_Square
TR301 = HM2102NL: as TR201 on sheet primary_LTC; Part Number: HM2102NL; Manufacturer: Pulse; Operating Temperature: -40°C - +125°C; ComponentLink1Description: Datasheet; ComponentLink1URL: https://www.mouser.com/ds/2/336/HM2102NL-1218600.pdf; Supplier 1: Mouser; Supplier Part Number 1: 673-HM2102NL; Supplier 2: Digikey; Supplier Part Number 2: 1840-1034-1-ND

## Sheet cell_fuses.SchDoc: foxBMS BMS-Slave 12-Cell
size A3; DocumentNumber: 4; SheetNumber: 4; SheetTotal: 19; AUTHOR: Fraunhofer IISB foxBMS Team; SheetDescription: Cell Voltage Sense Fuses
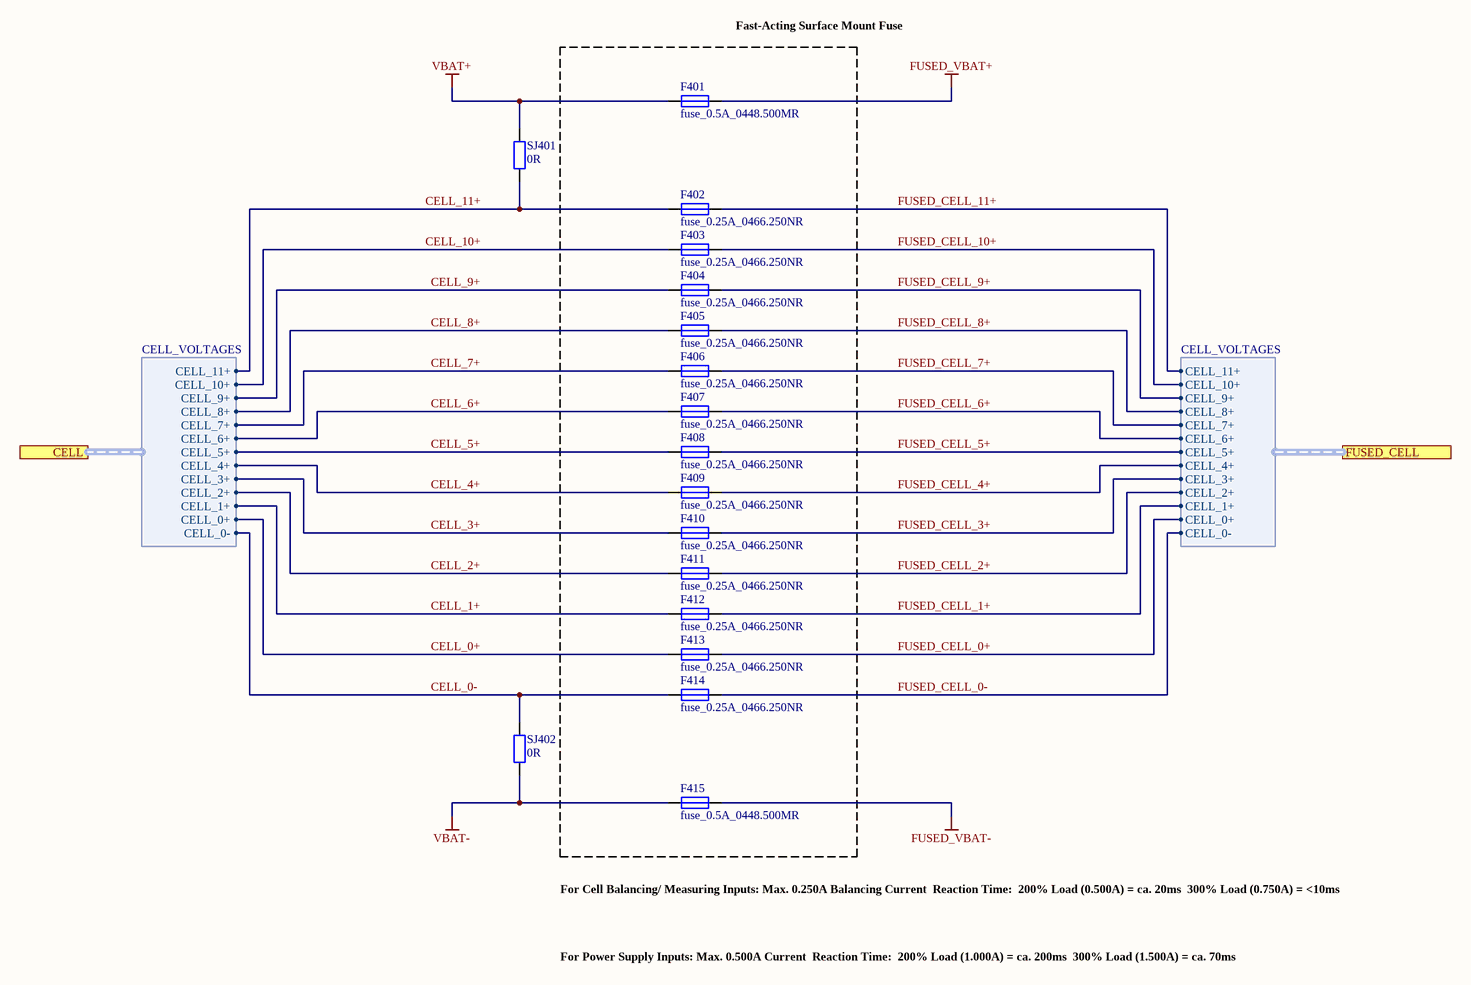
[diagram p2: cell_fuses.SchDoc]

### Parts
F401  fuse_0.5A_0448.500MR  [LITTLEFUSE_448]
F402  fuse_0.25A_0466.250NR  [LITTLEFUSE_466]
F403  fuse_0.25A_0466.250NR  [LITTLEFUSE_466]
F404  fuse_0.25A_0466.250NR  [LITTLEFUSE_466]
F405  fuse_0.25A_0466.250NR  [LITTLEFUSE_466]
F406  fuse_0.25A_0466.250NR  [LITTLEFUSE_466]
F407  fuse_0.25A_0466.250NR  [LITTLEFUSE_466]
F408  fuse_0.25A_0466.250NR  [LITTLEFUSE_466]
F409  fuse_0.25A_0466.250NR  [LITTLEFUSE_466]
F410  fuse_0.25A_0466.250NR  [LITTLEFUSE_466]
F411  fuse_0.25A_0466.250NR  [LITTLEFUSE_466]
F412  fuse_0.25A_0466.250NR  [LITTLEFUSE_466]
F413  fuse_0.25A_0466.250NR  [LITTLEFUSE_466]
F414  fuse_0.25A_0466.250NR  [LITTLEFUSE_466]
F415  fuse_0.5A_0448.500MR  [LITTLEFUSE_448]
SJ401  0R  [RESC1608X05N]
SJ402  0R  [RESC1608X05N]

### Blocks framed on the sheet
Fast-Acting Surface Mount Fuse: F401-F415

### Ports
CELL (harness CELL_VOLTAGES), FUSED_CELL (harness CELL_VOLTAGES)

### Harnesses
CELL_VOLTAGES: CELL_0-, CELL_0+, CELL_1+, CELL_10+, CELL_11+, CELL_2+, CELL_3+, CELL_4+, CELL_5+, CELL_6+, CELL_7+, CELL_8+, CELL_9+

### Nets
FUSED_VBAT+: F401.2
FUSED_VBAT-: F415.2
VBAT+: F401.1 SJ401.1
VBAT-: F415.1 SJ402.2
CELL_0+: F413.1 ; port CELL.CELL_0+
CELL_0-: F414.1 SJ402.1 ; port CELL.CELL_0-
CELL_1+: F412.1 ; port CELL.CELL_1+
CELL_2+: F411.1 ; port CELL.CELL_2+
CELL_3+: F410.1 ; port CELL.CELL_3+
CELL_4+: F409.1 ; port CELL.CELL_4+
CELL_5+: F408.1 ; port CELL.CELL_5+
CELL_6+: F407.1 ; port CELL.CELL_6+
CELL_7+: F406.1 ; port CELL.CELL_7+
CELL_8+: F405.1 ; port CELL.CELL_8+
CELL_9+: F404.1 ; port CELL.CELL_9+
CELL_10+: F403.1 ; port CELL.CELL_10+
CELL_11+: F402.1 SJ401.2 ; port CELL.CELL_11+
FUSED_CELL_0+: F413.2 ; port FUSED_CELL.CELL_0+
FUSED_CELL_0-: F414.2 ; port FUSED_CELL.CELL_0-
FUSED_CELL_1+: F412.2 ; port FUSED_CELL.CELL_1+
FUSED_CELL_2+: F411.2 ; port FUSED_CELL.CELL_2+
FUSED_CELL_3+: F410.2 ; port FUSED_CELL.CELL_3+
FUSED_CELL_4+: F409.2 ; port FUSED_CELL.CELL_4+
FUSED_CELL_5+: F408.2 ; port FUSED_CELL.CELL_5+
FUSED_CELL_6+: F407.2 ; port FUSED_CELL.CELL_6+
FUSED_CELL_7+: F406.2 ; port FUSED_CELL.CELL_7+
FUSED_CELL_8+: F405.2 ; port FUSED_CELL.CELL_8+
FUSED_CELL_9+: F404.2 ; port FUSED_CELL.CELL_9+
FUSED_CELL_10+: F403.2 ; port FUSED_CELL.CELL_10+
FUSED_CELL_11+: F402.2 ; port FUSED_CELL.CELL_11+

### Notes on the sheet
- For Cell Balancing/ Measuring Inputs: Max. 0.250A Balancing Current
  Reaction Time:
  200% Load (0.500A) = ca. 20ms
  300% Load (0.750A) = <10ms
- For Power Supply Inputs: Max. 0.500A Current
  Reaction Time:
  200% Load (1.000A) = ca. 200ms
  300% Load (1.500A) = ca. 70ms
- Fraunhofer IISB
- Schottkystr. 10
- developed by:
- 91058 Erlangen
- Germany
- Author
- Project
- License
- Description
- File
- Version
- Release Date
- Sheet
- www.foxbms.org
- www.iisb.fraunhofer.de
- foxBMS Team
- /

### Library data of the parts
F401 F415 = fuse_0.5A_0448.500MR: Fuse, Surface Mount, NANO2 Series, 500 mA, 125 VAC, 32 VDC, Very Fast Acting, SMD; Manufacturer: Littlefuse; Automotive Qualified: False; Part Number: fuse_0.5A_0448.500MR; Operating Temperature: -55°C - +125°C; ComponentLink1Description: Datasheet; ComponentLink1URL: http://www.farnell.com/datasheets/1792947.pdf; Supplier 1: Farnell; Supplier Part Number 1: 1596919
F402-F414 = fuse_0.25A_0466.250NR: Fuse, Surface Mount, 466 Series, 250 mA, 125 VAC, 125 VDC, Very Fast Acting, 1206; Manufacturer: Littlefuse; Automotive Qualified: False; Part Number: fuse_0.25A_0466.250NR; Operating Temperature: -55°C - +90°C; ComponentLink1Description: Datasheet; ComponentLink1URL: http://www.farnell.com/datasheets/1796765.pdf; Supplier 1: Farnell; Supplier Part Number 1: 9921826
SJ401 SJ402 = gen_R_0R_0603: as R209 on sheet primary_LTC; Part Number: gen_R_0R_0603; Operating Temperature: -55°C - +155°C; Resistance: 0R; Series: Jumper; PnP Value: 0R; Supplier 1: Farnell; Supplier Part Number 1: 2073345

## Sheet primary_decoupling.SchDoc: foxBMS BMS-Slave 12-Cell
size A3; DocumentNumber: 5; SheetNumber: 5; SheetTotal: 19; AUTHOR: Fraunhofer IISB foxBMS Team; SheetDescription: Primary Voltage Measurement
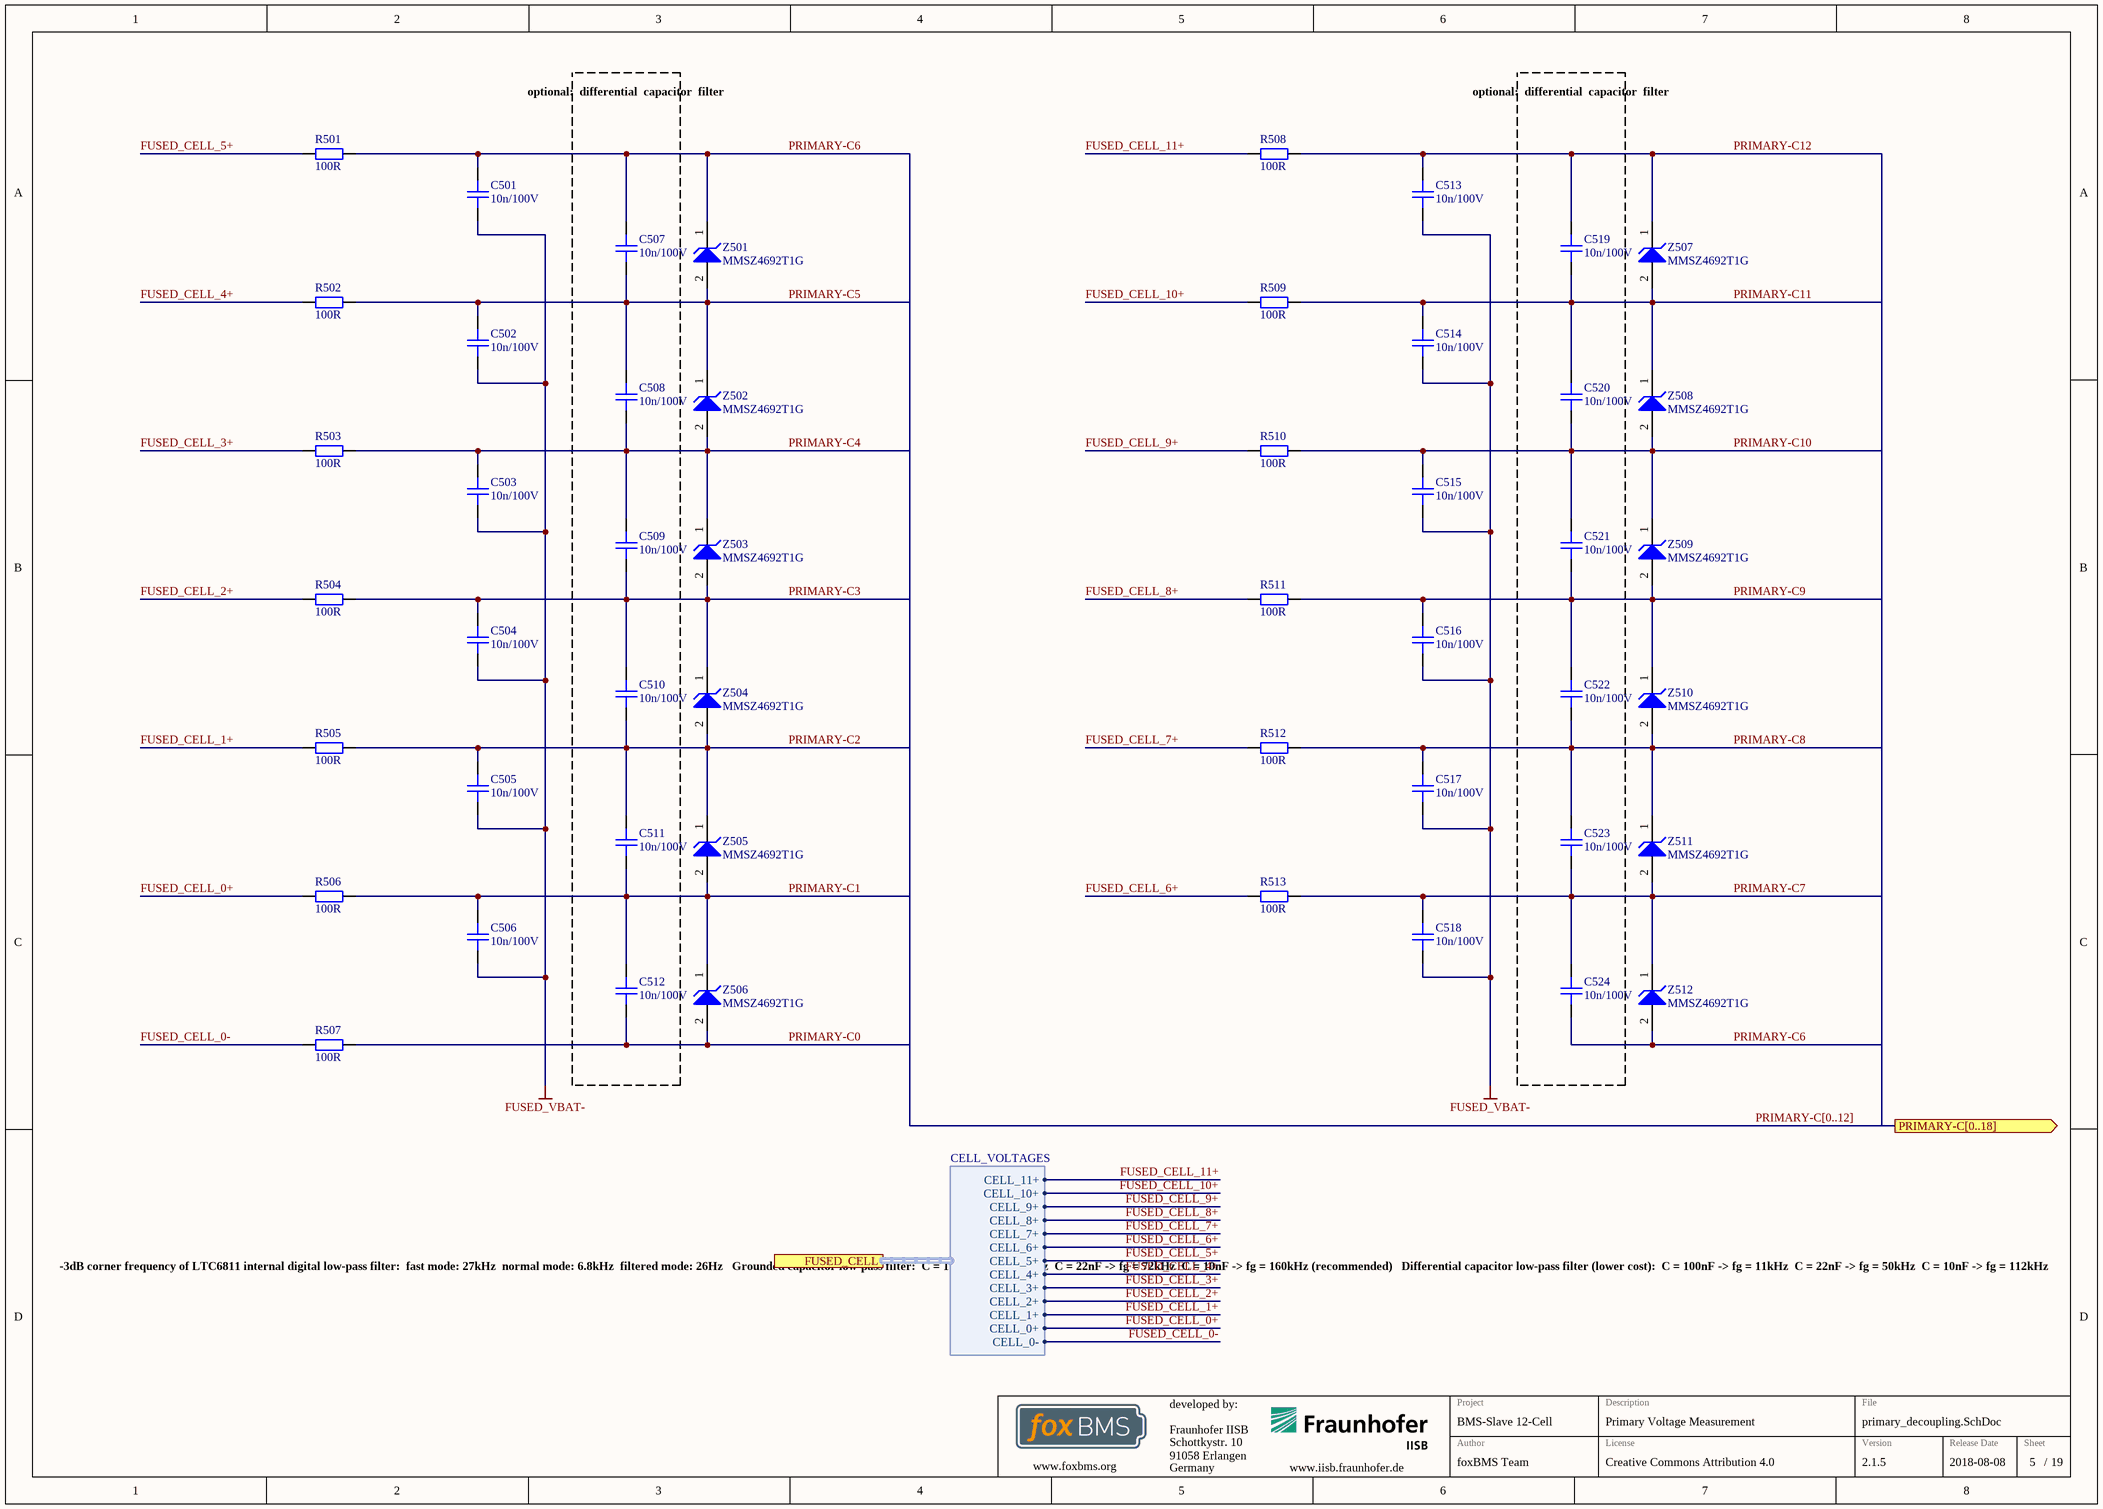
[diagram p3: primary_decoupling.SchDoc]

### Parts
C501  10n/100V  [CAPC1608X08N]
C502  10n/100V  [CAPC1608X08N]
C503  10n/100V  [CAPC1608X08N]
C504  10n/100V  [CAPC1608X08N]
C505  10n/100V  [CAPC1608X08N]
C506  10n/100V  [CAPC1608X08N]
C507  10n/100V  [CAPC1608X08N]
C508  10n/100V  [CAPC1608X08N]
C509  10n/100V  [CAPC1608X08N]
C510  10n/100V  [CAPC1608X08N]
C511  10n/100V  [CAPC1608X08N]
C512  10n/100V  [CAPC1608X08N]
C513  10n/100V  [CAPC1608X08N]
C514  10n/100V  [CAPC1608X08N]
C515  10n/100V  [CAPC1608X08N]
C516  10n/100V  [CAPC1608X08N]
C517  10n/100V  [CAPC1608X08N]
C518  10n/100V  [CAPC1608X08N]
C519  10n/100V  [CAPC1608X08N]
C520  10n/100V  [CAPC1608X08N]
C521  10n/100V  [CAPC1608X08N]
C522  10n/100V  [CAPC1608X08N]
C523  10n/100V  [CAPC1608X08N]
C524  10n/100V  [CAPC1608X08N]
R501  100R  [RESC1608X05N]
R502  100R  [RESC1608X05N]
R503  100R  [RESC1608X05N]
R504  100R  [RESC1608X05N]
R505  100R  [RESC1608X05N]
R506  100R  [RESC1608X05N]
R507  100R  [RESC1608X05N]
R508  100R  [RESC1608X05N]
R509  100R  [RESC1608X05N]
R510  100R  [RESC1608X05N]
R511  100R  [RESC1608X05N]
R512  100R  [RESC1608X05N]
R513  100R  [RESC1608X05N]
Z501  MMSZ4692T1G  [ONSC-SOD-123-2-425-04_V]
Z502  MMSZ4692T1G  [ONSC-SOD-123-2-425-04_V]
Z503  MMSZ4692T1G  [ONSC-SOD-123-2-425-04_V]
Z504  MMSZ4692T1G  [ONSC-SOD-123-2-425-04_V]
Z505  MMSZ4692T1G  [ONSC-SOD-123-2-425-04_V]
Z506  MMSZ4692T1G  [ONSC-SOD-123-2-425-04_V]
Z507  MMSZ4692T1G  [ONSC-SOD-123-2-425-04_V]
Z508  MMSZ4692T1G  [ONSC-SOD-123-2-425-04_V]
Z509  MMSZ4692T1G  [ONSC-SOD-123-2-425-04_V]
Z510  MMSZ4692T1G  [ONSC-SOD-123-2-425-04_V]
Z511  MMSZ4692T1G  [ONSC-SOD-123-2-425-04_V]
Z512  MMSZ4692T1G  [ONSC-SOD-123-2-425-04_V]

### Blocks framed on the sheet
optional: / differential / capacitor / filter: C507-C512
optional: / differential / capacitor / filter: C519-C524

### Ports
FUSED_CELL (harness CELL_VOLTAGES), PRIMARY-C[0..18] (out)

### Harnesses
CELL_VOLTAGES: CELL_0-, CELL_0+, CELL_1+, CELL_10+, CELL_11+, CELL_2+, CELL_3+, CELL_4+, CELL_5+, CELL_6+, CELL_7+, CELL_8+, CELL_9+

### Nets
FUSED_VBAT-: C501.2 C502.2 C503.2 C504.2 C505.2 C506.2 C513.2 C514.2 C515.2 C516.2 C517.2 C518.2
FUSED_CELL_0+: R506.1 ; port FUSED_CELL.CELL_0+
FUSED_CELL_0-: R507.1 ; port FUSED_CELL.CELL_0-
FUSED_CELL_1+: R505.1 ; port FUSED_CELL.CELL_1+
FUSED_CELL_2+: R504.1 ; port FUSED_CELL.CELL_2+
FUSED_CELL_3+: R503.1 ; port FUSED_CELL.CELL_3+
FUSED_CELL_4+: R502.1 ; port FUSED_CELL.CELL_4+
FUSED_CELL_5+: R501.1 ; port FUSED_CELL.CELL_5+
FUSED_CELL_6+: R513.1 ; port FUSED_CELL.CELL_6+
FUSED_CELL_7+: R512.1 ; port FUSED_CELL.CELL_7+
FUSED_CELL_8+: R511.1 ; port FUSED_CELL.CELL_8+
FUSED_CELL_9+: R510.1 ; port FUSED_CELL.CELL_9+
FUSED_CELL_10+: R509.1 ; port FUSED_CELL.CELL_10+
FUSED_CELL_11+: R508.1 ; port FUSED_CELL.CELL_11+
PRIMARY-C0: C512.2 R507.2 Z506.2(A)
PRIMARY-C1: C506.1 C511.2 C512.1 R506.2 Z505.2(A) Z506.1(K)
PRIMARY-C2: C505.1 C510.2 C511.1 R505.2 Z504.2(A) Z505.1(K)
PRIMARY-C3: C504.1 C509.2 C510.1 R504.2 Z503.2(A) Z504.1(K)
PRIMARY-C4: C503.1 C508.2 C509.1 R503.2 Z502.2(A) Z503.1(K)
PRIMARY-C5: C502.1 C507.2 C508.1 R502.2 Z501.2(A) Z502.1(K)
PRIMARY-C6: C501.1 C507.1 C524.2 R501.2 Z501.1(K) Z512.2(A)
PRIMARY-C7: C518.1 C523.2 C524.1 R513.2 Z511.2(A) Z512.1(K)
PRIMARY-C8: C517.1 C522.2 C523.1 R512.2 Z510.2(A) Z511.1(K)
PRIMARY-C9: C516.1 C521.2 C522.1 R511.2 Z509.2(A) Z510.1(K)
PRIMARY-C10: C515.1 C520.2 C521.1 R510.2 Z508.2(A) Z509.1(K)
PRIMARY-C11: C514.1 C519.2 C520.1 R509.2 Z507.2(A) Z508.1(K)
PRIMARY-C12: C513.1 C519.1 R508.2 Z507.1(K)

### Buses and harness runs
bus PRIMARY-C[0..12] = port PRIMARY-C[0..18]

### Notes on the sheet
- -3dB corner frequency of LTC6811 internal digital low-pass filter:
  fast mode: 27kHz
  normal mode: 6.8kHz
  filtered mode: 26Hz
  Grounded capacitor low-pass filter:
  C = 100nF -> fg = 16kHz
  C = 22nF -> fg = 72kHz
  C = 10nF -> fg = 160kHz (recommended)
  Differential capacitor low-pass filter (lower cost):
  C = 100nF -> fg = 11kHz
  C = 22nF -> fg = 50kHz
  C = 10nF -> fg = 112kHz
- Fraunhofer IISB
- Schottkystr. 10
- developed by:
- 91058 Erlangen
- Germany
- Author
- Project
- License
- Description
- File
- Version
- Release Date
- Sheet
- www.foxbms.org
- www.iisb.fraunhofer.de
- foxBMS Team
- /

### Library data of the parts
C501-C524 = gen_C_ceramic_10n_100V_X7R_0603: MLCC; Capacitance: 10n; Rated Voltage: 100V; Dielectric: X7R; Case EIA: 0603; Case Metric: 1608; Automotive Qualified: False; Part Number: gen_C_ceramic_10n_100V_X7R_0603; Supplier 1: Farnell; Supplier Part Number 1: 1865545
R501-R513 = gen_R_100R_0603: SMD Resistor 100R 0603; Tolerance: 1%; Power: 0.1W; Case EIA: 0603; Case Metric: 1608; Maximum Working Voltage: 75V; PnP Package: R_0603; Automotive Qualified: False; Part Number: gen_R_100R_0603; Operating Temperature: -55°C - +155°C; Resistance: 100R; Series: E24, E96; PnP Value: 100R; Supplier 1: Farnell; Supplier Part Number 1: 1469752
Z501-Z512 = CMP-1060-00434-1: Zener Voltage Regulator, 500 mW, 2-Pin SOD-123, Pb-Free, Tape and Reel; Manufacturer: On Semiconductor; VZ Typ (V): 6.8; P Max (W): 0.5; ComponentLink2URL: http://www.onsemi.com/pub_link/Collateral/MMSZ4678T1-D.PDF; Mounting Technology: Surface Mount; DatasheetVersion: Rev. 9; ComponentLink1Description: Manufacturer URL; ComponentLink3URL: http://www.onsemi.com/pub_link/Collateral/425-04.PDF; PackageReference: SOD-123-2-425-04; ComponentLink2Description: Datasheet; RoHS: Pb-Free; Packing: Tape and Reel; ComponentLink1URL: http://www.onsemi.com/; PackageDescription: 2-Pin SOD, Body 1.6 x 2.69 mm; ComponentLink3Description: Package Specification; PartNumber: MMSZ4692T1G; PackageVersion: Rev. G, 10/2009

## Sheet secondary_decoupling.SchDoc: foxBMS BMS-Slave 12-Cell
size A3; DocumentNumber: 6; SheetNumber: 6; SheetTotal: 19; AUTHOR: Fraunhofer IISB foxBMS Team; SheetDescription: Secondary Voltage Measurement
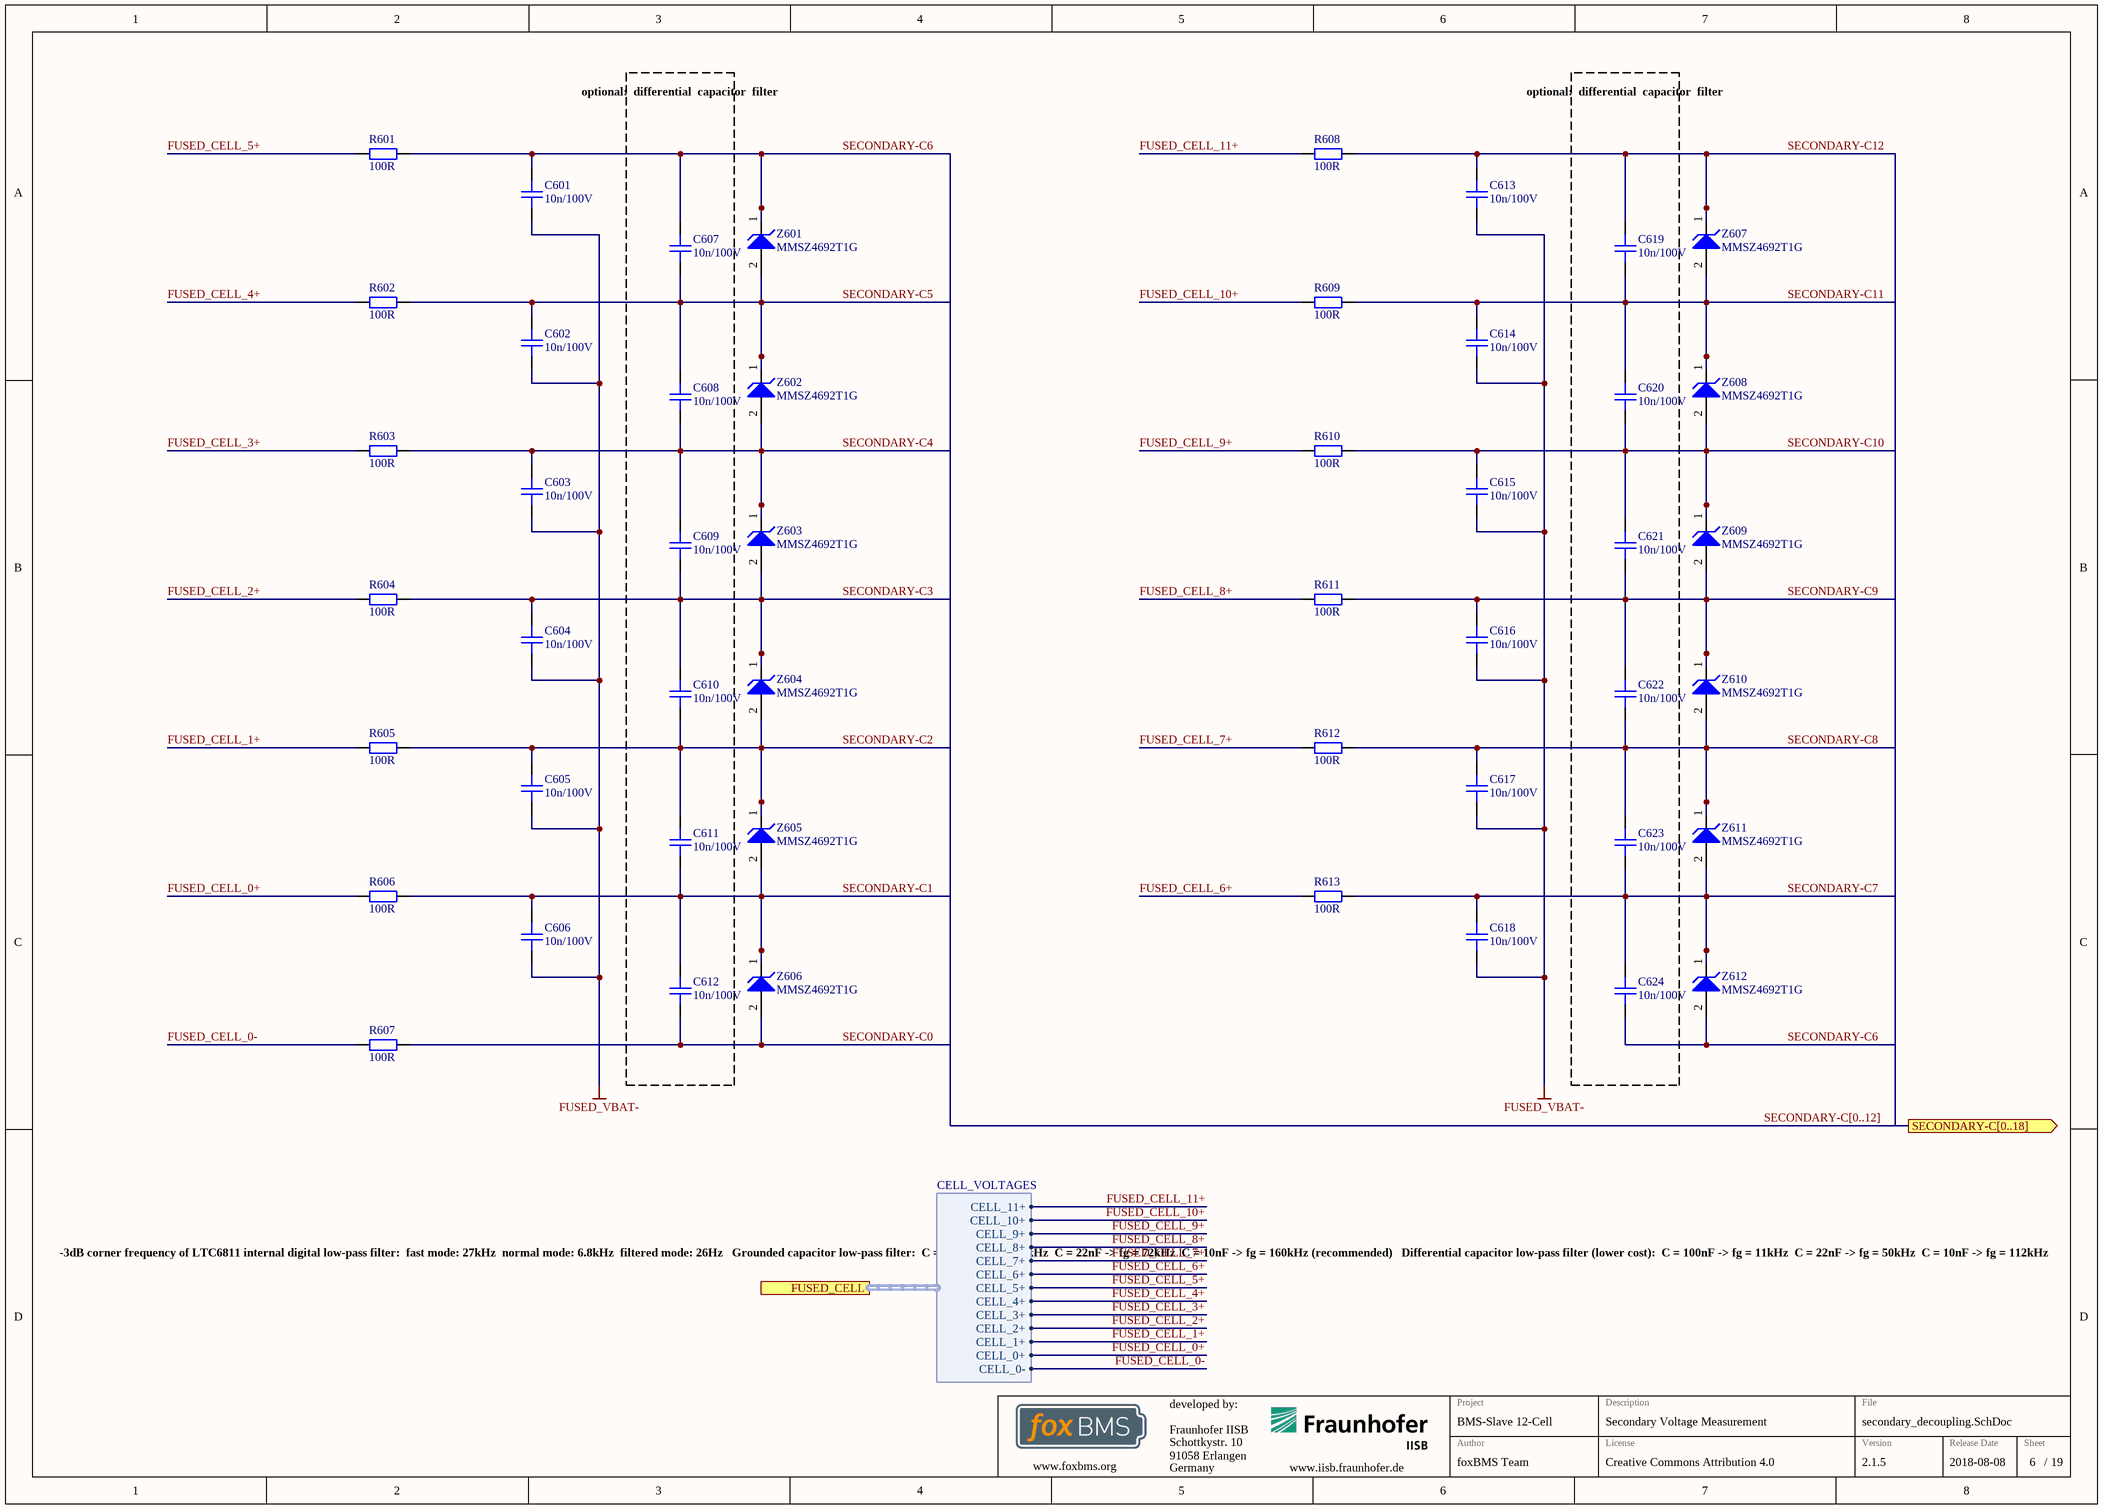
[diagram p4: secondary_decoupling.SchDoc]

### Parts
C601  10n/100V  [CAPC1608X08N]
C602  10n/100V  [CAPC1608X08N]
C603  10n/100V  [CAPC1608X08N]
C604  10n/100V  [CAPC1608X08N]
C605  10n/100V  [CAPC1608X08N]
C606  10n/100V  [CAPC1608X08N]
C607  10n/100V  [CAPC1608X08N]
C608  10n/100V  [CAPC1608X08N]
C609  10n/100V  [CAPC1608X08N]
C610  10n/100V  [CAPC1608X08N]
C611  10n/100V  [CAPC1608X08N]
C612  10n/100V  [CAPC1608X08N]
C613  10n/100V  [CAPC1608X08N]
C614  10n/100V  [CAPC1608X08N]
C615  10n/100V  [CAPC1608X08N]
C616  10n/100V  [CAPC1608X08N]
C617  10n/100V  [CAPC1608X08N]
C618  10n/100V  [CAPC1608X08N]
C619  10n/100V  [CAPC1608X08N]
C620  10n/100V  [CAPC1608X08N]
C621  10n/100V  [CAPC1608X08N]
C622  10n/100V  [CAPC1608X08N]
C623  10n/100V  [CAPC1608X08N]
C624  10n/100V  [CAPC1608X08N]
R601  100R  [RESC1608X05N]
R602  100R  [RESC1608X05N]
R603  100R  [RESC1608X05N]
R604  100R  [RESC1608X05N]
R605  100R  [RESC1608X05N]
R606  100R  [RESC1608X05N]
R607  100R  [RESC1608X05N]
R608  100R  [RESC1608X05N]
R609  100R  [RESC1608X05N]
R610  100R  [RESC1608X05N]
R611  100R  [RESC1608X05N]
R612  100R  [RESC1608X05N]
R613  100R  [RESC1608X05N]
Z601  MMSZ4692T1G  [ONSC-SOD-123-2-425-04_V]
Z602  MMSZ4692T1G  [ONSC-SOD-123-2-425-04_V]
Z603  MMSZ4692T1G  [ONSC-SOD-123-2-425-04_V]
Z604  MMSZ4692T1G  [ONSC-SOD-123-2-425-04_V]
Z605  MMSZ4692T1G  [ONSC-SOD-123-2-425-04_V]
Z606  MMSZ4692T1G  [ONSC-SOD-123-2-425-04_V]
Z607  MMSZ4692T1G  [ONSC-SOD-123-2-425-04_V]
Z608  MMSZ4692T1G  [ONSC-SOD-123-2-425-04_V]
Z609  MMSZ4692T1G  [ONSC-SOD-123-2-425-04_V]
Z610  MMSZ4692T1G  [ONSC-SOD-123-2-425-04_V]
Z611  MMSZ4692T1G  [ONSC-SOD-123-2-425-04_V]
Z612  MMSZ4692T1G  [ONSC-SOD-123-2-425-04_V]

### Blocks framed on the sheet
optional: / differential / capacitor / filter: C607-C612
optional: / differential / capacitor / filter: C619-C624

### Ports
FUSED_CELL (harness CELL_VOLTAGES), SECONDARY-C[0..18] (out)

### Harnesses
CELL_VOLTAGES: CELL_0-, CELL_0+, CELL_1+, CELL_10+, CELL_11+, CELL_2+, CELL_3+, CELL_4+, CELL_5+, CELL_6+, CELL_7+, CELL_8+, CELL_9+

### Nets
FUSED_VBAT-: C601.2 C602.2 C603.2 C604.2 C605.2 C606.2 C613.2 C614.2 C615.2 C616.2 C617.2 C618.2
FUSED_CELL_0+: R606.1 ; port FUSED_CELL.CELL_0+
FUSED_CELL_0-: R607.1 ; port FUSED_CELL.CELL_0-
FUSED_CELL_1+: R605.1 ; port FUSED_CELL.CELL_1+
FUSED_CELL_2+: R604.1 ; port FUSED_CELL.CELL_2+
FUSED_CELL_3+: R603.1 ; port FUSED_CELL.CELL_3+
FUSED_CELL_4+: R602.1 ; port FUSED_CELL.CELL_4+
FUSED_CELL_5+: R601.1 ; port FUSED_CELL.CELL_5+
FUSED_CELL_6+: R613.1 ; port FUSED_CELL.CELL_6+
FUSED_CELL_7+: R612.1 ; port FUSED_CELL.CELL_7+
FUSED_CELL_8+: R611.1 ; port FUSED_CELL.CELL_8+
FUSED_CELL_9+: R610.1 ; port FUSED_CELL.CELL_9+
FUSED_CELL_10+: R609.1 ; port FUSED_CELL.CELL_10+
FUSED_CELL_11+: R608.1 ; port FUSED_CELL.CELL_11+
SECONDARY-C0: C612.2 R607.2 Z606.2(A)
SECONDARY-C1: C606.1 C611.2 C612.1 R606.2 Z605.2(A) Z606.1(K)
SECONDARY-C2: C605.1 C610.2 C611.1 R605.2 Z604.2(A) Z605.1(K)
SECONDARY-C3: C604.1 C609.2 C610.1 R604.2 Z603.2(A) Z604.1(K)
SECONDARY-C4: C603.1 C608.2 C609.1 R603.2 Z602.2(A) Z603.1(K)
SECONDARY-C5: C602.1 C607.2 C608.1 R602.2 Z601.2(A) Z602.1(K)
SECONDARY-C6: C601.1 C607.1 C624.2 R601.2 Z601.1(K) Z612.2(A)
SECONDARY-C7: C618.1 C623.2 C624.1 R613.2 Z611.2(A) Z612.1(K)
SECONDARY-C8: C617.1 C622.2 C623.1 R612.2 Z610.2(A) Z611.1(K)
SECONDARY-C9: C616.1 C621.2 C622.1 R611.2 Z609.2(A) Z610.1(K)
SECONDARY-C10: C615.1 C620.2 C621.1 R610.2 Z608.2(A) Z609.1(K)
SECONDARY-C11: C614.1 C619.2 C620.1 R609.2 Z607.2(A) Z608.1(K)
SECONDARY-C12: C613.1 C619.1 R608.2 Z607.1(K)

### Buses and harness runs
bus SECONDARY-C[0..12] = port SECONDARY-C[0..18]

### Notes on the sheet
- -3dB corner frequency of LTC6811 internal digital low-pass filter:
  fast mode: 27kHz
  normal mode: 6.8kHz
  filtered mode: 26Hz
  Grounded capacitor low-pass filter:
  C = 100nF -> fg = 16kHz
  C = 22nF -> fg = 72kHz
  C = 10nF -> fg = 160kHz (recommended)
  Differential capacitor low-pass filter (lower cost):
  C = 100nF -> fg = 11kHz
  C = 22nF -> fg = 50kHz
  C = 10nF -> fg = 112kHz
- Fraunhofer IISB
- Schottkystr. 10
- developed by:
- 91058 Erlangen
- Germany
- Author
- Project
- License
- Description
- File
- Version
- Release Date
- Sheet
- www.foxbms.org
- www.iisb.fraunhofer.de
- foxBMS Team
- /

### Library data of the parts
C601-C624 = gen_C_ceramic_10n_100V_X7R_0603: as C501 on sheet primary_decoupling; Part Number: gen_C_ceramic_10n_100V_X7R_0603; Supplier 1: Farnell; Supplier Part Number 1: 1865545
R601-R613 = gen_R_100R_0603: as R501 on sheet primary_decoupling; Part Number: gen_R_100R_0603; Operating Temperature: -55°C - +155°C; Resistance: 100R; Series: E24, E96; PnP Value: 100R; Supplier 1: Farnell; Supplier Part Number 1: 1469752
Z601-Z612 = CMP-1060-00434-1: as Z501 on sheet primary_decoupling; ComponentLink2URL: http://www.onsemi.com/pub_link/Collateral/MMSZ4678T1-D.PDF; Mounting Technology: Surface Mount; DatasheetVersion: Rev. 9; ComponentLink1Description: Manufacturer URL; ComponentLink3URL: http://www.onsemi.com/pub_link/Collateral/425-04.PDF; PackageReference: SOD-123-2-425-04; ComponentLink2Description: Datasheet; RoHS: Pb-Free; Packing: Tape and Reel; ComponentLink1URL: http://www.onsemi.com/; PackageDescription: 2-Pin SOD, Body 1.6 x 2.69 mm; ComponentLink3Description: Package Specification; PartNumber: MMSZ4692T1G; PackageVersion: Rev. G, 10/2009

## Sheet passive_balancing.SchDoc: foxBMS BMS-Slave 12-Cell
size A3; DocumentNumber: 7; SheetNumber: 7; SheetTotal: 19; AUTHOR: Fraunhofer IISB foxBMS Team; SheetDescription: Passive Cell Balancing
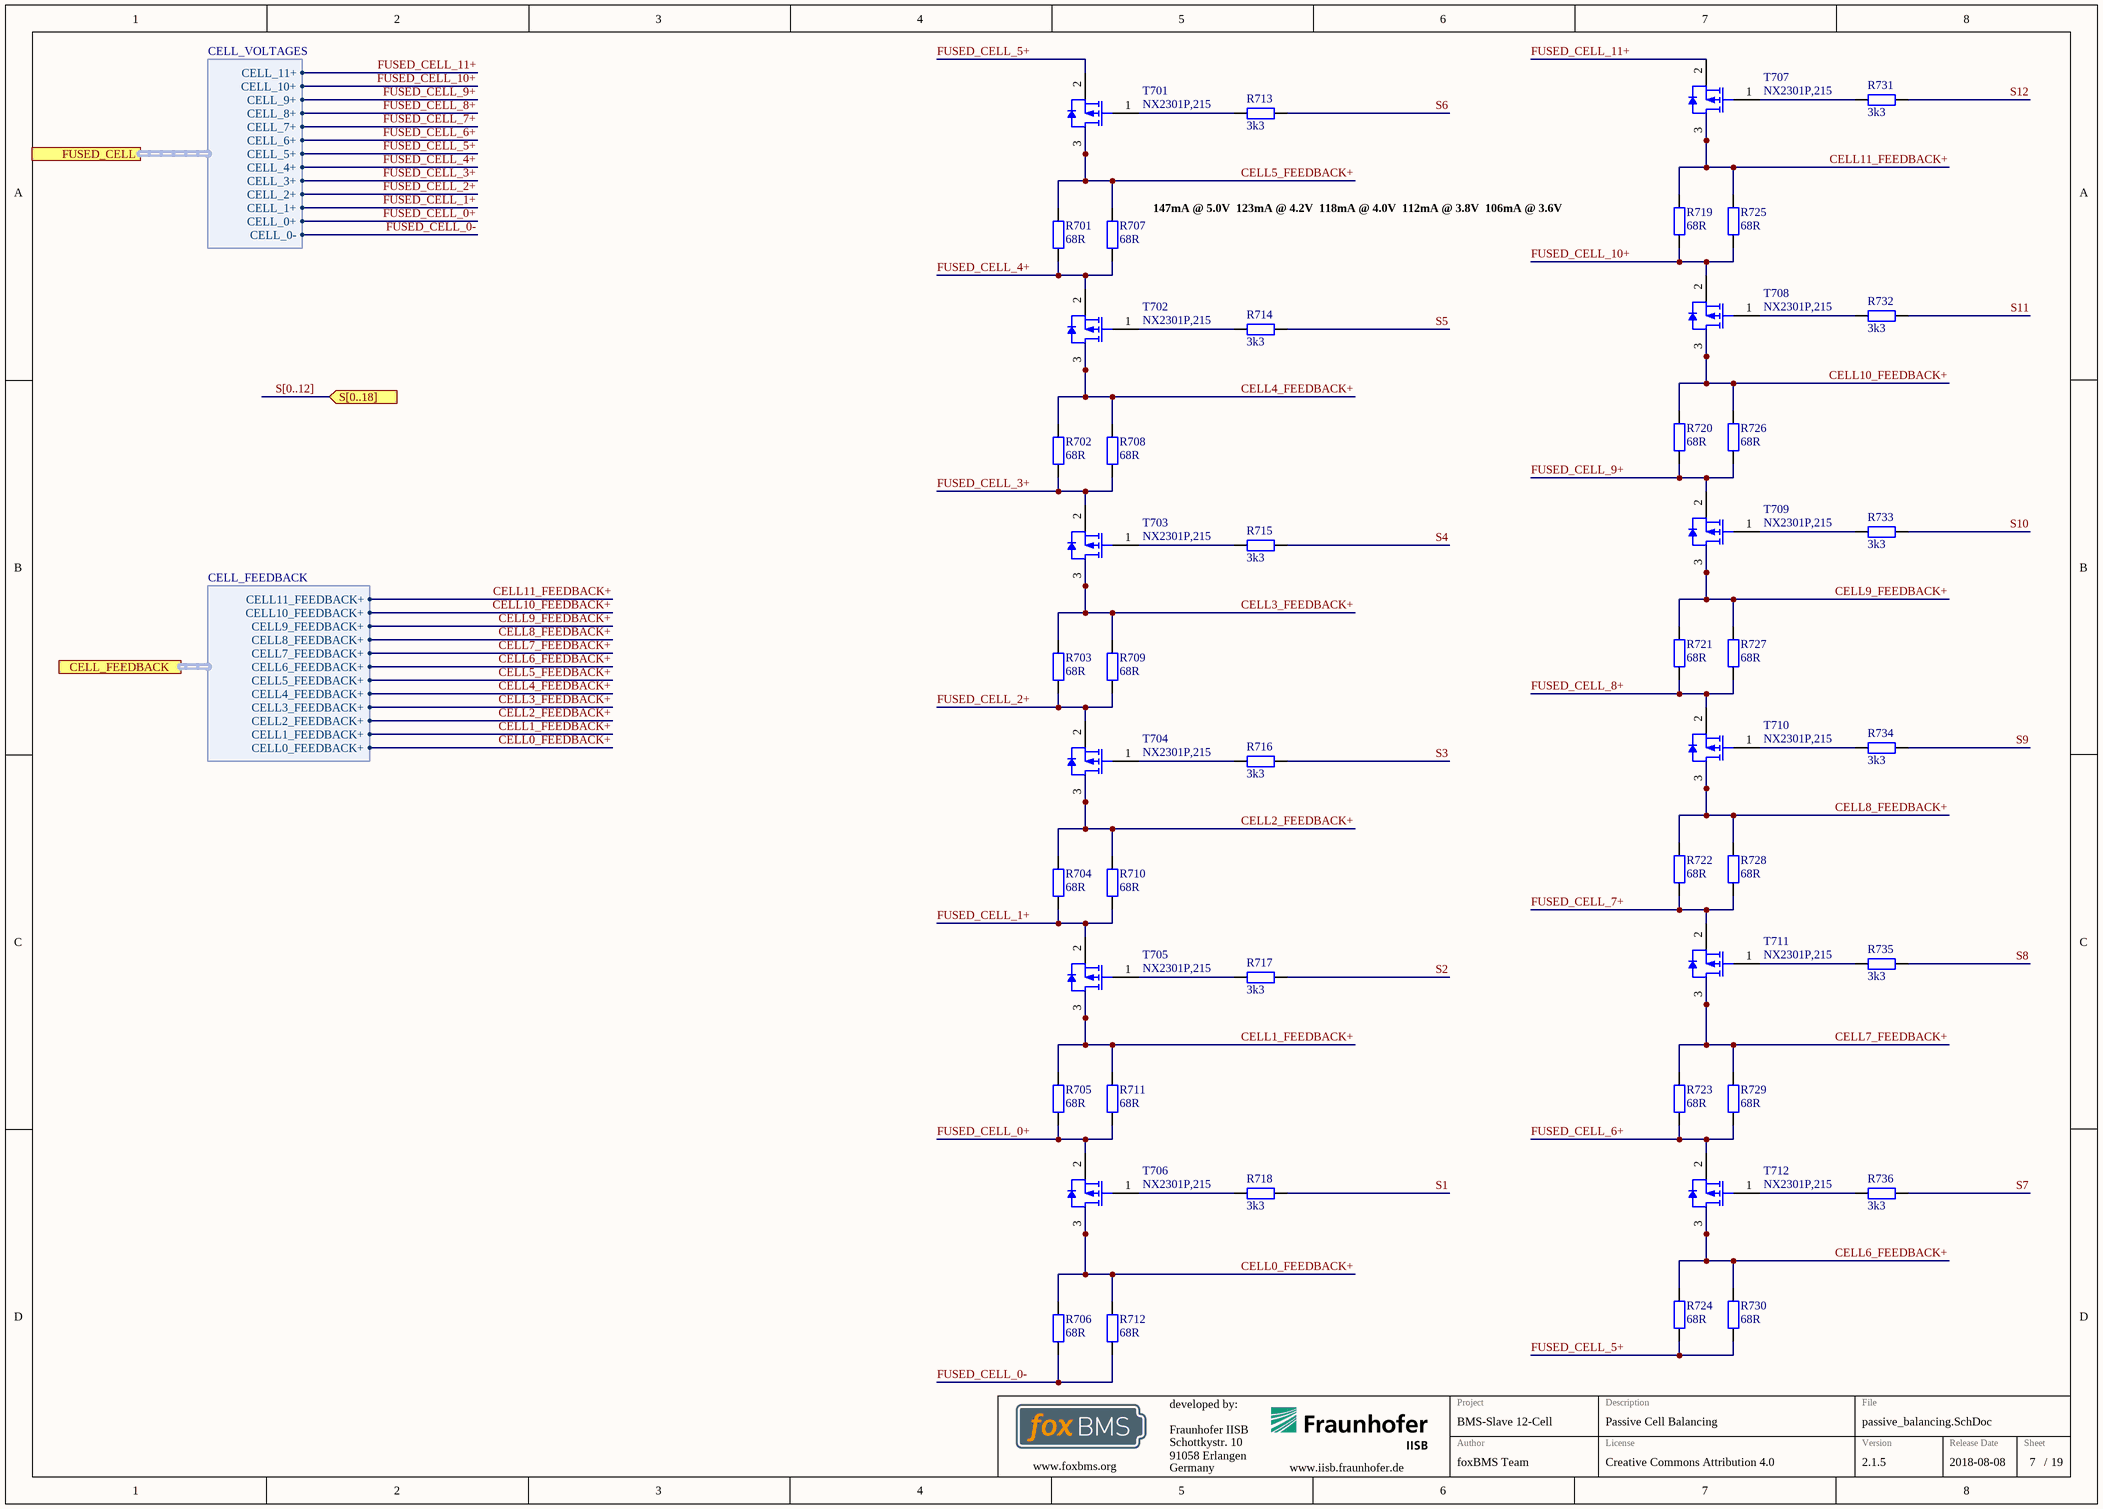
[diagram p5: passive_balancing.SchDoc]

### Parts
R701  68R  [RESC5025X07N]
R702  68R  [RESC5025X07N]
R703  68R  [RESC5025X07N]
R704  68R  [RESC5025X07N]
R705  68R  [RESC5025X07N]
R706  68R  [RESC5025X07N]
R707  68R  [RESC5025X07N]
R708  68R  [RESC5025X07N]
R709  68R  [RESC5025X07N]
R710  68R  [RESC5025X07N]
R711  68R  [RESC5025X07N]
R712  68R  [RESC5025X07N]
R713  3k3  [RESC1608X05N]
R714  3k3  [RESC1608X05N]
R715  3k3  [RESC1608X05N]
R716  3k3  [RESC1608X05N]
R717  3k3  [RESC1608X05N]
R718  3k3  [RESC1608X05N]
R719  68R  [RESC5025X07N]
R720  68R  [RESC5025X07N]
R721  68R  [RESC5025X07N]
R722  68R  [RESC5025X07N]
R723  68R  [RESC5025X07N]
R724  68R  [RESC5025X07N]
R725  68R  [RESC5025X07N]
R726  68R  [RESC5025X07N]
R727  68R  [RESC5025X07N]
R728  68R  [RESC5025X07N]
R729  68R  [RESC5025X07N]
R730  68R  [RESC5025X07N]
R731  3k3  [RESC1608X05N]
R732  3k3  [RESC1608X05N]
R733  3k3  [RESC1608X05N]
R734  3k3  [RESC1608X05N]
R735  3k3  [RESC1608X05N]
R736  3k3  [RESC1608X05N]
T701  NX2301P,215  [NXP-SOT23_N]
T702  NX2301P,215  [NXP-SOT23_N]
T703  NX2301P,215  [NXP-SOT23_N]
T704  NX2301P,215  [NXP-SOT23_N]
T705  NX2301P,215  [NXP-SOT23_N]
T706  NX2301P,215  [NXP-SOT23_N]
T707  NX2301P,215  [NXP-SOT23_N]
T708  NX2301P,215  [NXP-SOT23_N]
T709  NX2301P,215  [NXP-SOT23_N]
T710  NX2301P,215  [NXP-SOT23_N]
T711  NX2301P,215  [NXP-SOT23_N]
T712  NX2301P,215  [NXP-SOT23_N]

### Ports
CELL_FEEDBACK (harness CELL_FEEDBACK), FUSED_CELL (harness CELL_VOLTAGES), S[0..18] (in)

### Harnesses
CELL_VOLTAGES: CELL_0-, CELL_0+, CELL_1+, CELL_10+, CELL_11+, CELL_2+, CELL_3+, CELL_4+, CELL_5+, CELL_6+, CELL_7+, CELL_8+, CELL_9+
CELL_FEEDBACK: CELL11_FEEDBACK+, CELL10_FEEDBACK+, CELL9_FEEDBACK+, CELL8_FEEDBACK+, CELL7_FEEDBACK+, CELL6_FEEDBACK+, CELL5_FEEDBACK+, CELL4_FEEDBACK+, CELL3_FEEDBACK+, CELL2_FEEDBACK+, CELL1_FEEDBACK+, CELL0_FEEDBACK+

### Nets
CELL0_FEEDBACK+: R706.2 R712.2 T706.3(D) ; port CELL_FEEDBACK.CELL0_FEEDBACK+
CELL1_FEEDBACK+: R705.2 R711.2 T705.3(D) ; port CELL_FEEDBACK.CELL1_FEEDBACK+
CELL2_FEEDBACK+: R704.2 R710.2 T704.3(D) ; port CELL_FEEDBACK.CELL2_FEEDBACK+
CELL3_FEEDBACK+: R703.2 R709.2 T703.3(D) ; port CELL_FEEDBACK.CELL3_FEEDBACK+
CELL4_FEEDBACK+: R702.2 R708.2 T702.3(D) ; port CELL_FEEDBACK.CELL4_FEEDBACK+
CELL5_FEEDBACK+: R701.2 R707.2 T701.3(D) ; port CELL_FEEDBACK.CELL5_FEEDBACK+
CELL6_FEEDBACK+: R724.2 R730.2 T712.3(D) ; port CELL_FEEDBACK.CELL6_FEEDBACK+
CELL7_FEEDBACK+: R723.2 R729.2 T711.3(D) ; port CELL_FEEDBACK.CELL7_FEEDBACK+
CELL8_FEEDBACK+: R722.2 R728.2 T710.3(D) ; port CELL_FEEDBACK.CELL8_FEEDBACK+
CELL9_FEEDBACK+: R721.2 R727.2 T709.3(D) ; port CELL_FEEDBACK.CELL9_FEEDBACK+
CELL10_FEEDBACK+: R720.2 R726.2 T708.3(D) ; port CELL_FEEDBACK.CELL10_FEEDBACK+
CELL11_FEEDBACK+: R719.2 R725.2 T707.3(D) ; port CELL_FEEDBACK.CELL11_FEEDBACK+
FUSED_CELL_0+: R705.1 R711.1 T706.2(S) ; port FUSED_CELL.CELL_0+
FUSED_CELL_0-: R706.1 R712.1 ; port FUSED_CELL.CELL_0-
FUSED_CELL_1+: R704.1 R710.1 T705.2(S) ; port FUSED_CELL.CELL_1+
FUSED_CELL_2+: R703.1 R709.1 T704.2(S) ; port FUSED_CELL.CELL_2+
FUSED_CELL_3+: R702.1 R708.1 T703.2(S) ; port FUSED_CELL.CELL_3+
FUSED_CELL_4+: R701.1 R707.1 T702.2(S) ; port FUSED_CELL.CELL_4+
FUSED_CELL_5+: R724.1 R730.1 T701.2(S) ; port FUSED_CELL.CELL_5+
FUSED_CELL_6+: R723.1 R729.1 T712.2(S) ; port FUSED_CELL.CELL_6+
FUSED_CELL_7+: R722.1 R728.1 T711.2(S) ; port FUSED_CELL.CELL_7+
FUSED_CELL_8+: R721.1 R727.1 T710.2(S) ; port FUSED_CELL.CELL_8+
FUSED_CELL_9+: R720.1 R726.1 T709.2(S) ; port FUSED_CELL.CELL_9+
FUSED_CELL_10+: R719.1 R725.1 T708.2(S) ; port FUSED_CELL.CELL_10+
FUSED_CELL_11+: T707.2(S) ; port FUSED_CELL.CELL_11+
S1: R718.2
S2: R717.2
S3: R716.2
S4: R715.2
S5: R714.2
S6: R713.2
S7: R736.2
S8: R735.2
S9: R734.2
S10: R733.2
S11: R732.2
S12: R731.2
NetR713_1: R713.1 T701.1(G)
NetR714_1: R714.1 T702.1(G)
NetR715_1: R715.1 T703.1(G)
NetR716_1: R716.1 T704.1(G)
NetR717_1: R717.1 T705.1(G)
NetR718_1: R718.1 T706.1(G)
NetR731_1: R731.1 T707.1(G)
NetR732_1: R732.1 T708.1(G)
NetR733_1: R733.1 T709.1(G)
NetR734_1: R734.1 T710.1(G)
NetR735_1: R735.1 T711.1(G)
NetR736_1: R736.1 T712.1(G)

### Buses and harness runs
bus S[0..12] = port S[0..18]

### Notes on the sheet
- (near R707) 147mA @ 5.0V
  123mA @ 4.2V
  118mA @ 4.0V
  112mA @ 3.8V
  106mA @ 3.6V
- Fraunhofer IISB
- Schottkystr. 10
- developed by:
- 91058 Erlangen
- Germany
- Author
- Project
- License
- Description
- File
- Version
- Release Date
- Sheet
- www.foxbms.org
- www.iisb.fraunhofer.de
- foxBMS Team
- /

### Library data of the parts
R701-R712 R719-R730 = gen_R_68R_2010: SMD Resistor 68R 2010; Tolerance: 1%; Power: 0.75W; Case EIA: 2010; Case Metric: 5025; Maximum Working Voltage: 200V; PnP Package: R_2010; Automotive Qualified: False; Part Number: gen_R_68R_2010; Operating Temperature: -55°C - +155°C; Resistance: 68R; Series: E24; PnP Value: 68R; Supplier 1: Farnell; Supplier Part Number 1: 2323988
R713-R718 R731-R736 = gen_R_3k3_0603: SMD Resistor 3k3 0603; Tolerance: 1%; Power: 0.1W; Case EIA: 0603; Case Metric: 1608; Maximum Working Voltage: 75V; PnP Package: R_0603; Automotive Qualified: False; Part Number: gen_R_3k3_0603; Operating Temperature: -55°C - +155°C; Resistance: 3k3; Series: E24; PnP Value: 3k3; Supplier 1: Farnell; Supplier Part Number 1: 1469793
T701-T712 = CMP-1259-00090-1: P-Channel Trench MOSFET, -20 V, -2 A, -55 to 150 degC, 3-Pin SOT23, Tape and Reel; Manufacturer: NXP Semiconductors; VGSth [typ] (V): -0.75; Channel Type: P; Packing: Tape & Reel; Automotive Qualified: Y; IDM [max] (A): -6; PackageReference: SOT23; PartNumber: NX2301P,215; PackageVersion: 06-03-16, 03/2006; ComponentLink1URL: http://www.nxp.com/; ID [max] (A): -2; Mounting Technology: Surface Mount; ComponentLink1Description: Manufacturer URL; VDS [max] (V): -20; Code_JEDEC: TO-236AB; DatasheetVersion: Rev. 1; ComponentLink3URL: http://www.nxp.com/documents/outline_drawing/sot023_po.pdf; ComponentLink2Description: Datasheet; PackageDescription: 3-Pin Small Outline Transistor Package, Body 2.9 x 1.3 mm, Pitch 0.95 mm; ComponentLink3Description: Package Specification; ComponentLink2URL: http://www.nxp.com/documents/data_sheet/NX2301P.pdf